# EAGLE design CanShark (EAGLE 6.5.0)
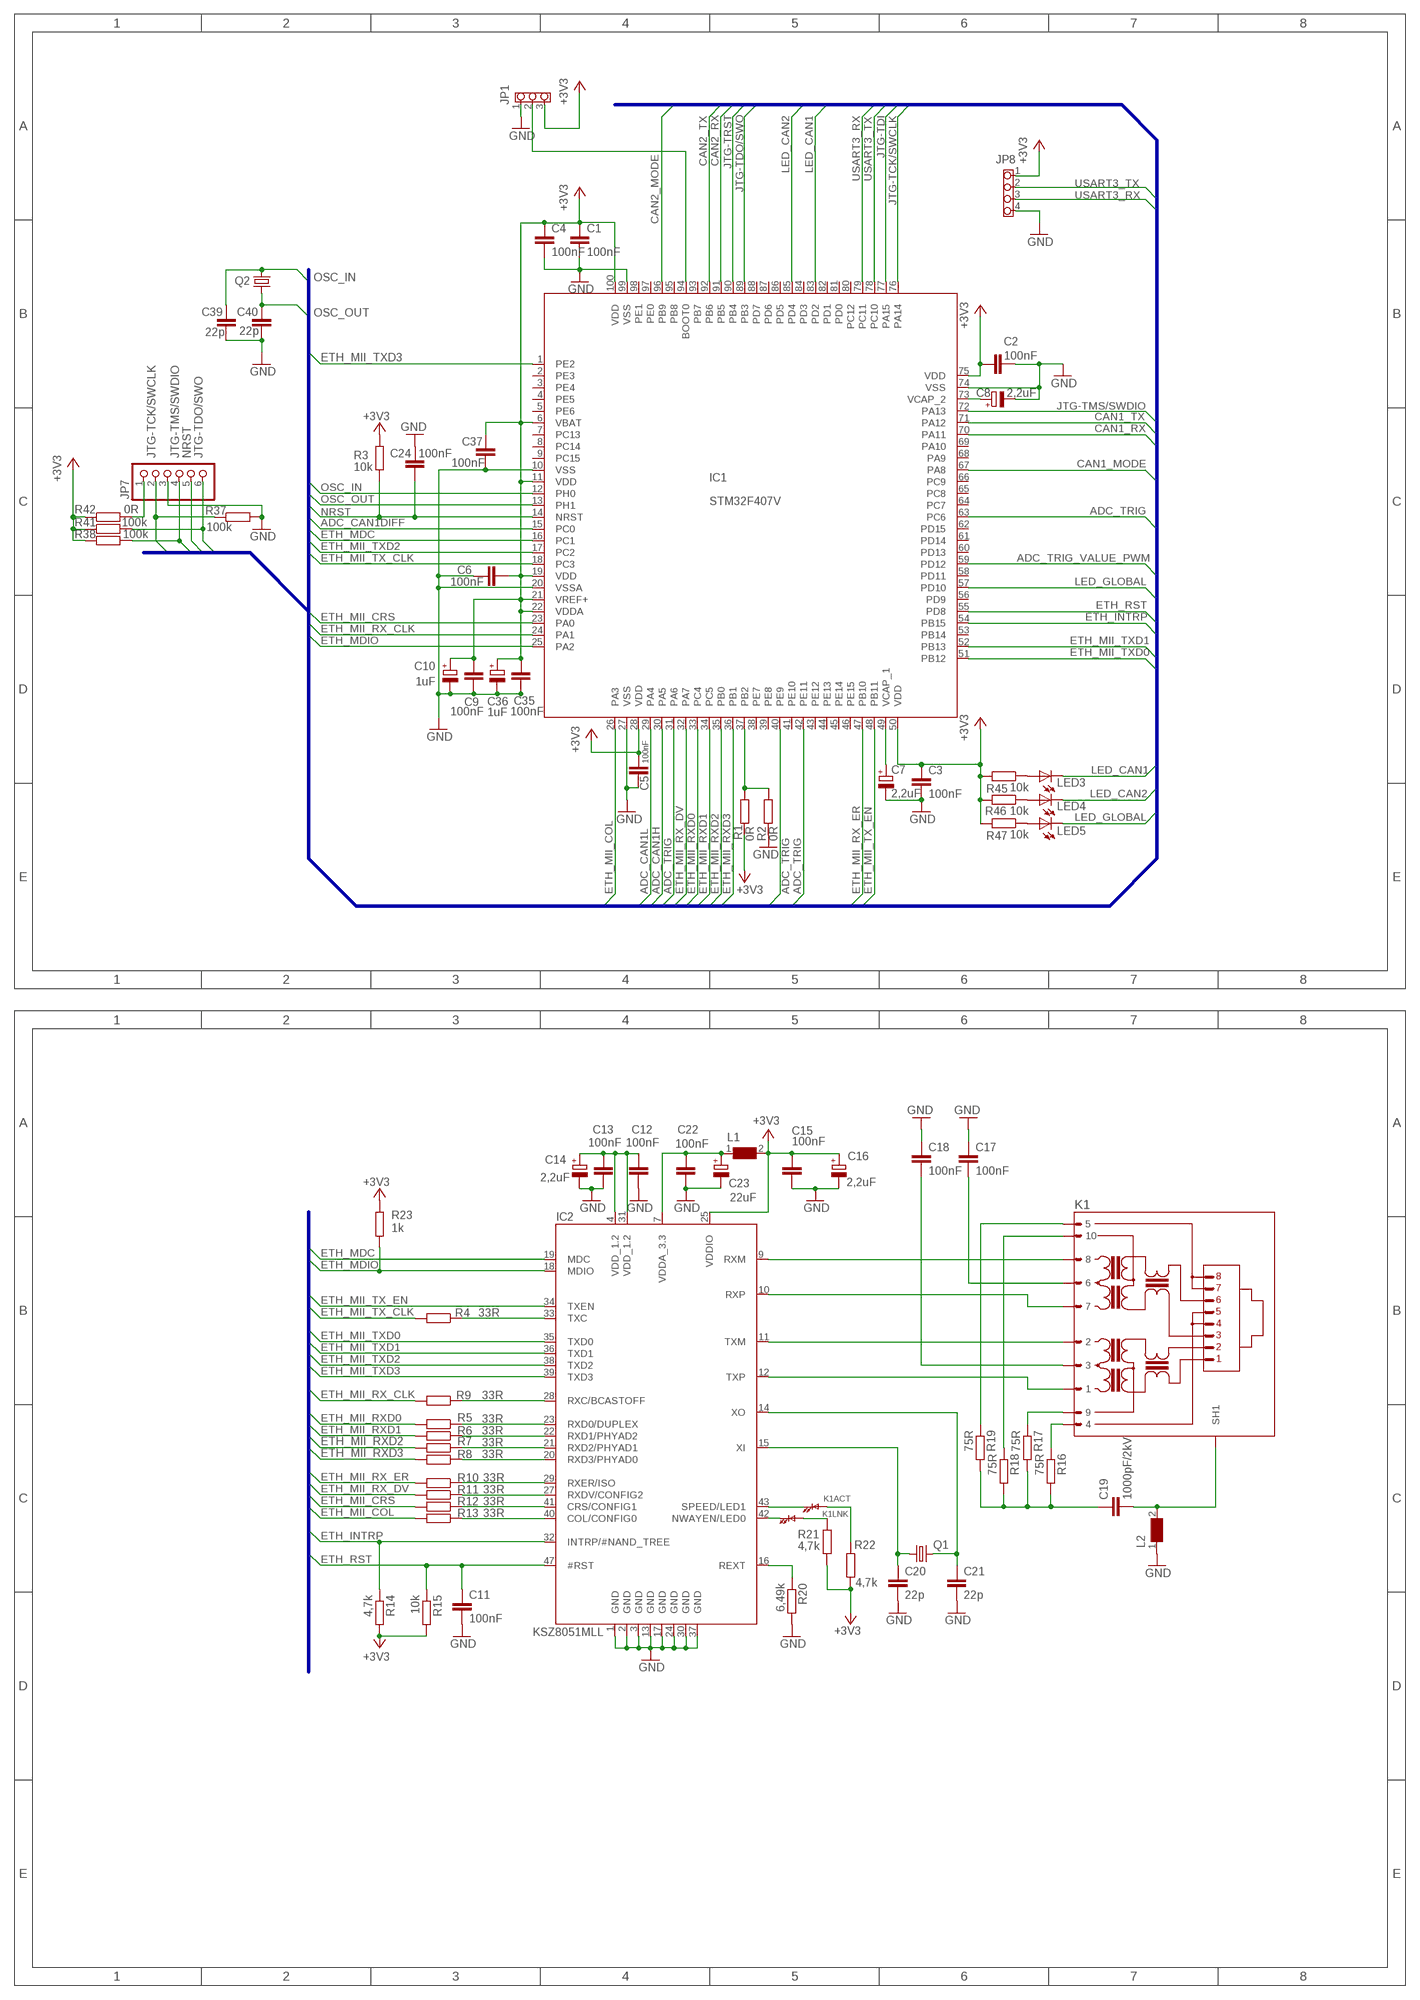
[diagram p0: schematic, sheet 1, part 1 of 3]
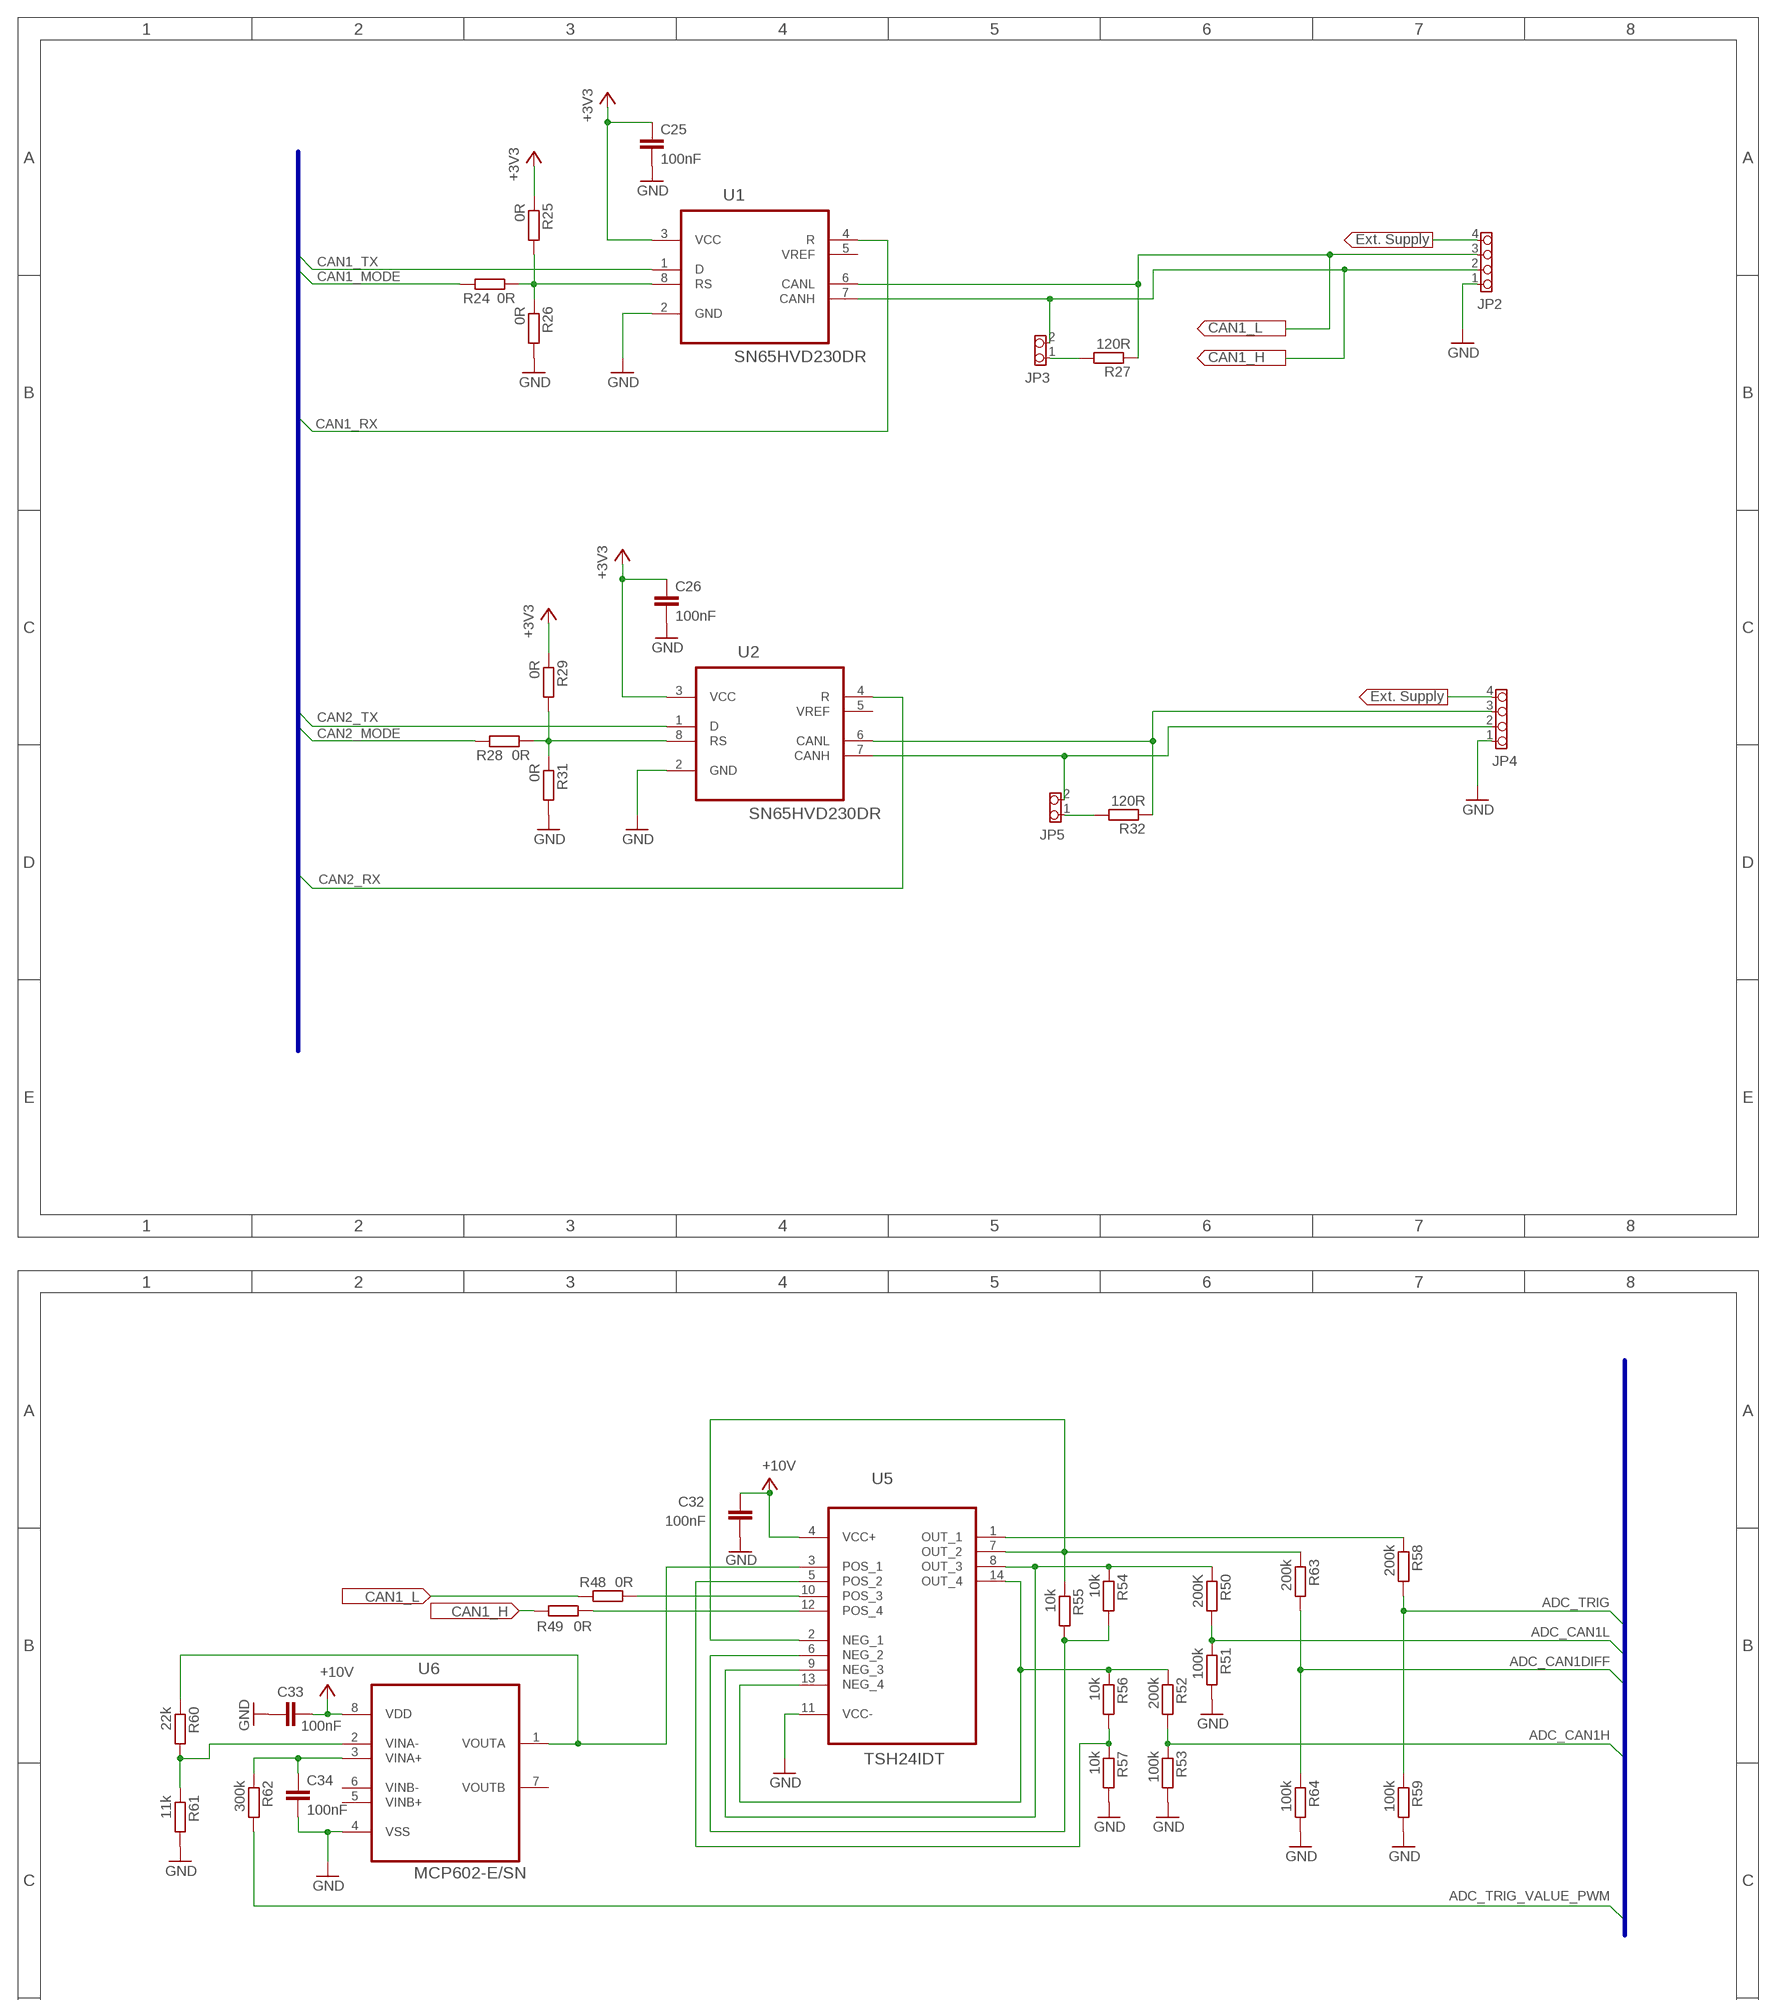
[diagram p1: schematic, sheet 1, part 2 of 3]
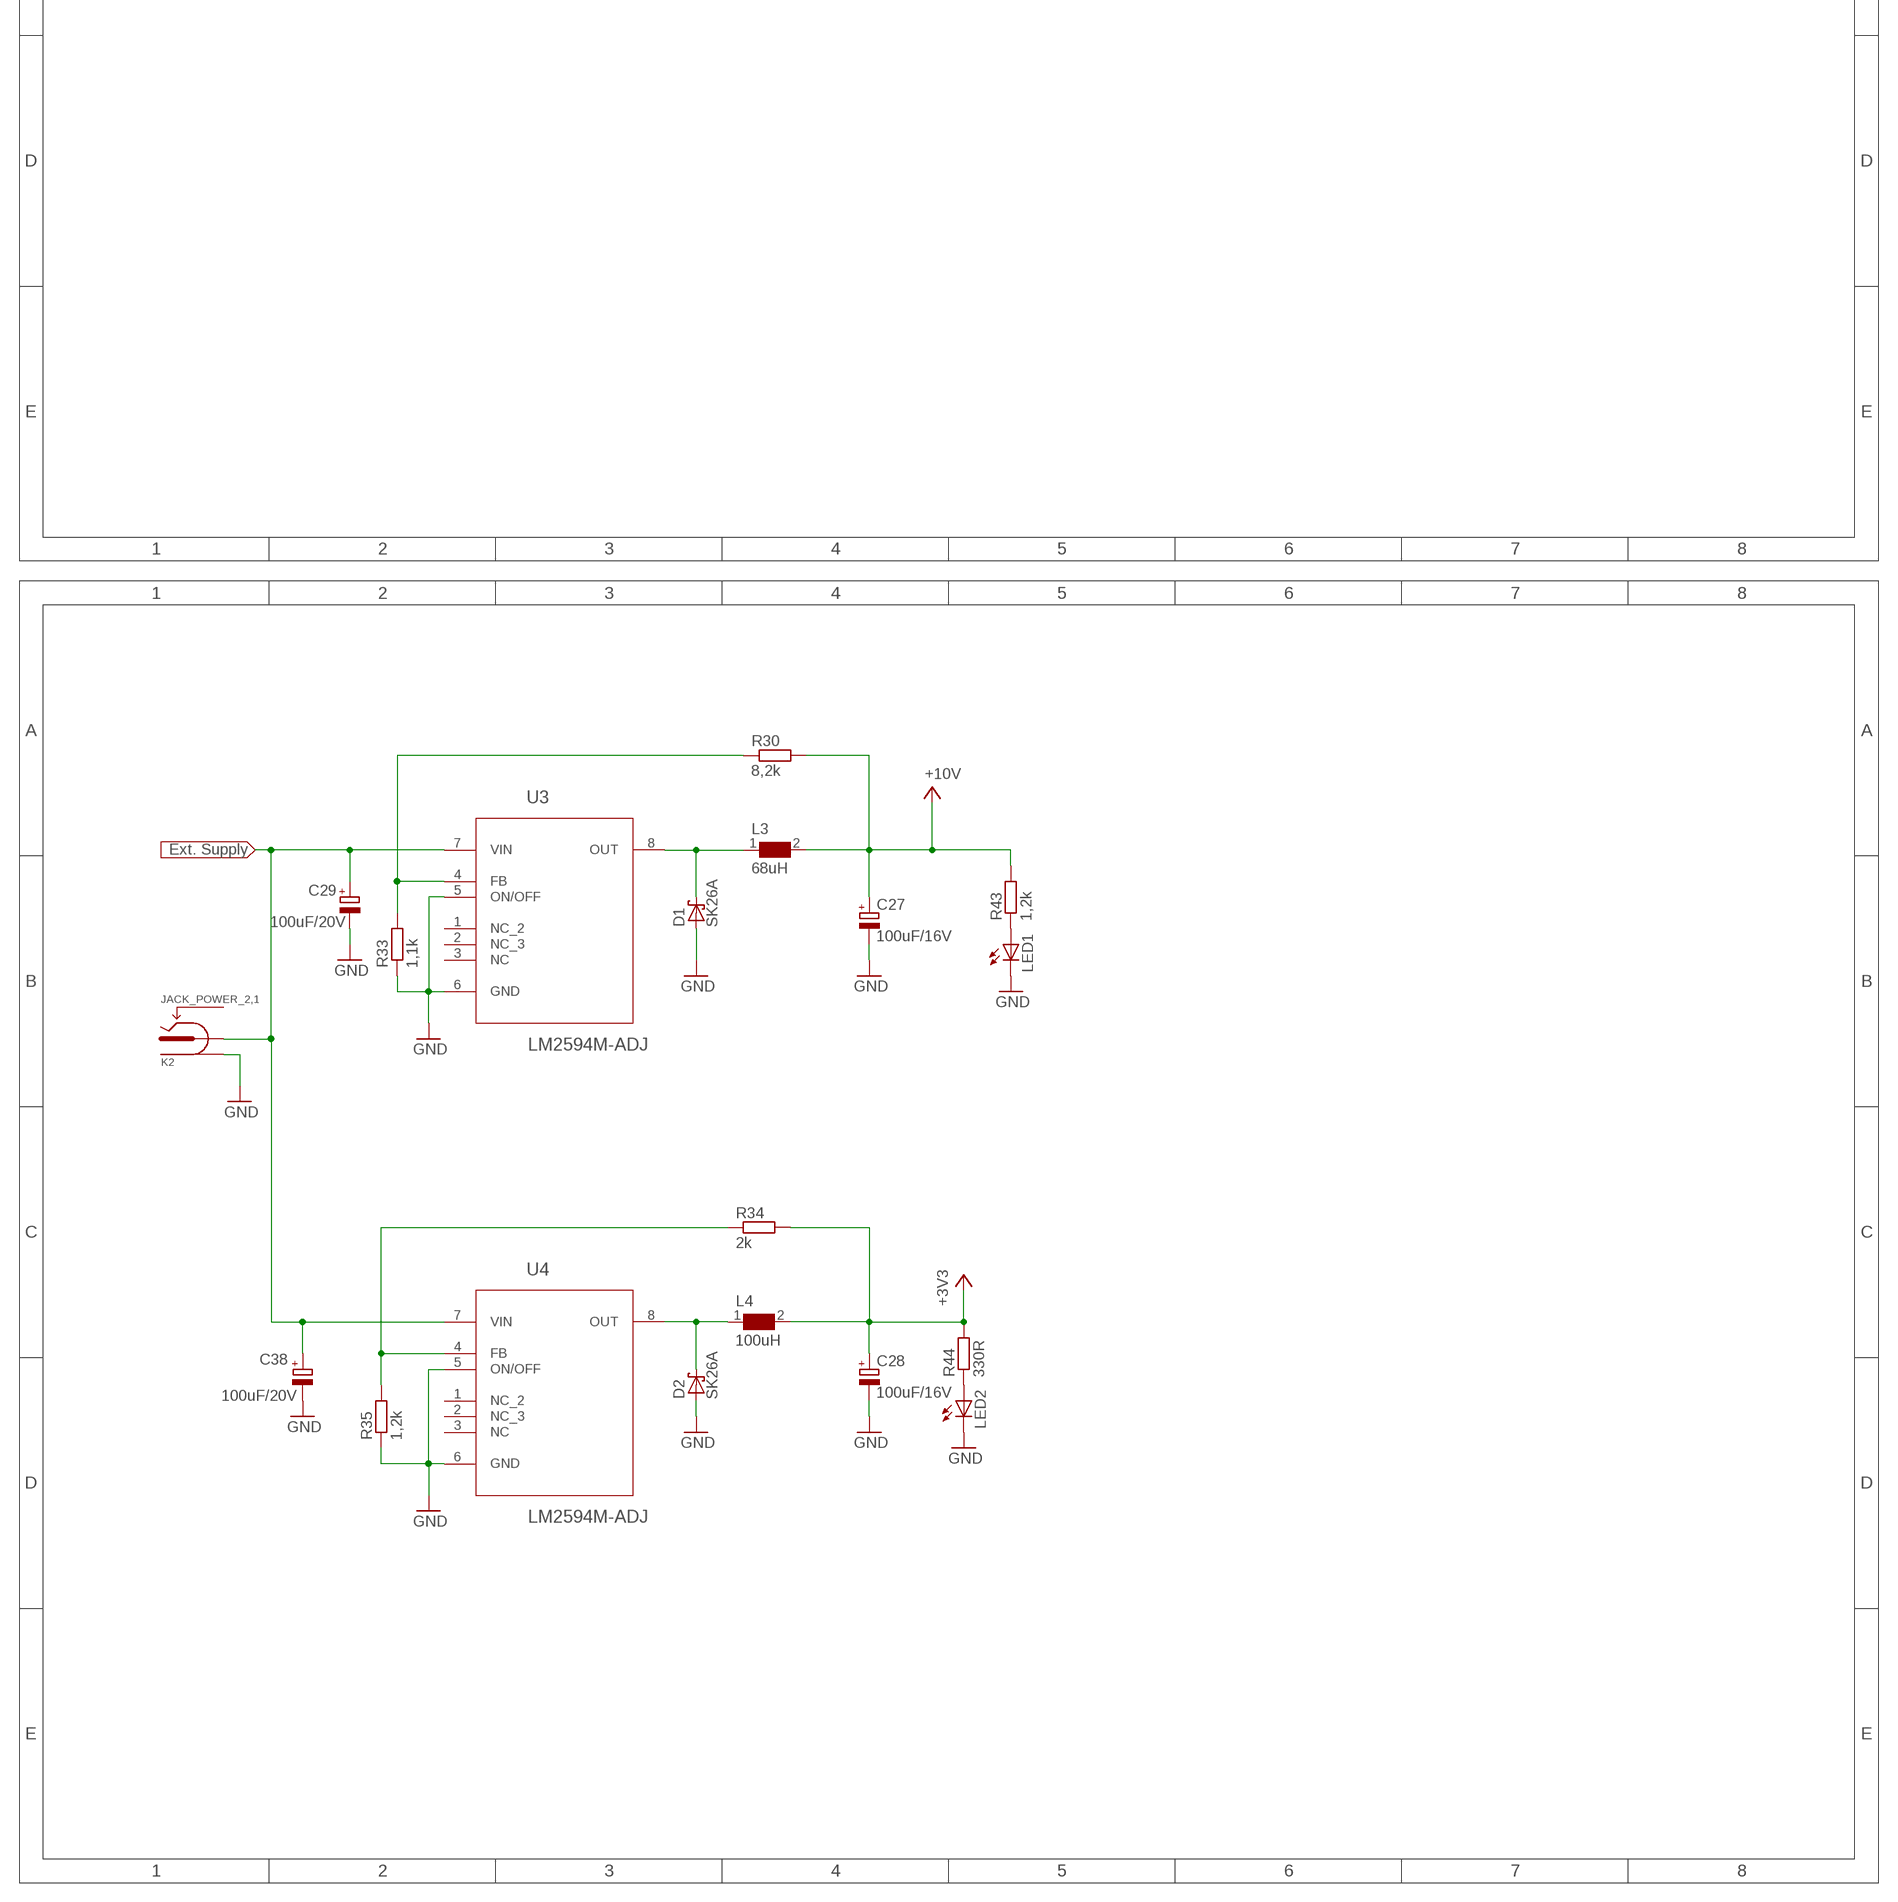
[diagram p2: schematic, sheet 1, part 3 of 3]

## Parts
C1  100nF  KERAMICKYSMD0603  [SMD0603]
C2  100nF  KERAMICKYSMD0603  [SMD0603]
C3  100nF  KERAMICKYSMD0603  [SMD0603]
C4  100nF  KERAMICKYSMD0603  [SMD0603]
C5  100nF  KERAMICKYSMD0603  [SMD0603]
C6  100nF  KERAMICKYSMD0603  [SMD0603]
C7  2,2uF  CPOL-EUSMCA  [SMC_A]
C8  2,2uF  CPOL-EUSMCA  [SMC_A]
C9  100nF  KERAMICKYSMD0603  [SMD0603]
C10  1uF  CPOL-EUSMCA  [SMC_A]
C11  100nF  KERAMICKYSMD0603  [SMD0603]
C12  100nF  KERAMICKYSMD0603  [SMD0603]
C13  100nF  KERAMICKYSMD0603  [SMD0603]
C14  2,2uF  CPOL-EUSMCA  [SMC_A]
C15  100nF  KERAMICKYSMD0603  [SMD0603]
C16  2,2uF  CPOL-EUSMCA  [SMC_A]
C17  100nF  KERAMICKYSMD0603  [SMD0603]
C18  100nF  KERAMICKYSMD0603  [SMD0603]
C19  1000pF/2kV  KERAMICKYSMD1206  [SMD1206]
C20  22p  KERAMICKYSMD0603  [SMD0603]
C21  22p  KERAMICKYSMD0603  [SMD0603]
C22  100nF  KERAMICKYSMD0603  [SMD0603]
C23  22uF  CPOL-EUSMCA  [SMC_A]
C24  100nF  KERAMICKYSMD0603  [SMD0603]
C25  100nF  KERAMICKYSMD0603  [SMD0603]
C26  100nF  KERAMICKYSMD0603  [SMD0603]
C27  100uF/16V  CPOL-EUC/6032-28R  [C/6032-28R]
C28  100uF/16V  CPOL-EUC/6032-28R  [C/6032-28R]
C29  100uF/20V  CPOL-EUC/6032-28R  [C/6032-28R]
C32  100nF  KERAMICKYSMD0603  [SMD0603]
C33  100nF  KERAMICKYSMD0603  [SMD0603]
C34  100nF  KERAMICKYSMD0603  [SMD0603]
C35  100nF  KERAMICKYSMD0603  [SMD0603]
C36  1uF  CPOL-EUSMCA  [SMC_A]
C37  100nF  KERAMICKYSMD0603  [SMD0603]
C38  100uF/20V  CPOL-EUC/6032-28R  [C/6032-28R]
C39  22p  KERAMICKYSMD0603  [SMD0603]
C40  22p  KERAMICKYSMD0603  [SMD0603]
D1  SK26A  SCHOTTKY-DIODESMD  [SMB]
D2  SK26A  SCHOTTKY-DIODESMD  [SMB]
IC1  STM32F407V  [LQFP100]
IC2  KSZ8051MLL  [LQFP48]
JP1  PINHD-1X3  [1X03_254]
JP2  PINHD-1X4_508_H  [1X04_508_H]
JP3  PINHD-1X2  [1X02_254]
JP4  PINHD-1X4_508_H  [1X04_508_H]
JP5  PINHD-1X2  [1X02_254]
JP7  PINHD-1X6  [1X06]
JP8  PINHD-1X4  [1X04_254]
K1  RJ45_TRAFO  [RJ45_TRAFO]
K2  JACK_POWER_2,1  [J_P_2,1]
L1  WE-CBF_HF-742863122_0603  [0603]
L2  WE-CBF_HF-742863122_0603  [0603]
L3  68uH  WE-TPC-744066180_1028/1038  [WE-TPC_1028/1038]
L4  100uH  WE-TPC-744066180_1028/1038  [WE-TPC_1028/1038]
LED1  LEDSML0603  [SML0603]
LED2  LEDSML0603  [SML0603]
LED3  TLLG4400  [LED3MM]
LED4  TLLG4400  [LED3MM]
LED5  TLLG4400  [LED3MM]
Q1  CRYSTALHC49U-V  [HC49U-V]
Q2  CRYSTALHC49U-V  [HC49U-V]
R1  0R  R-EU_R0603  [R0603]
R2  0R  R-EU_R0603  [R0603]
R3  10k  R-EU_R0603  [R0603]
R4  33R  R-EU_R0603  [R0603]
R5  33R  R-EU_R0603  [R0603]
R6  33R  R-EU_R0603  [R0603]
R7  33R  R-EU_R0603  [R0603]
R8  33R  R-EU_R0603  [R0603]
R9  33R  R-EU_R0603  [R0603]
R10  33R  R-EU_R0603  [R0603]
R11  33R  R-EU_R0603  [R0603]
R12  33R  R-EU_R0603  [R0603]
R13  33R  R-EU_R0603  [R0603]
R14  4,7k  R-EU_R0603  [R0603]
R15  10k  R-EU_R0603  [R0603]
R16  75R  R-EU_R0603  [R0603]
R17  75R  R-EU_R0603  [R0603]
R18  75R  R-EU_R0603  [R0603]
R19  75R  R-EU_R0603  [R0603]
R20  6,49k  R-EU_R0603  [R0603]
R21  4,7k  R-EU_R0603  [R0603]
R22  4,7k  R-EU_R0603  [R0603]
R23  1k  R-EU_R0603  [R0603]
R24  0R  R-EU_R0603  [R0603]
R25  0R  R-EU_R0603  [R0603]
R26  0R  R-EU_R0603  [R0603]
R27  120R  R-EU_R0603  [R0603]
R28  0R  R-EU_R0603  [R0603]
R29  0R  R-EU_R0603  [R0603]
R30  8,2k  R-EU_R0603  [R0603]
R31  0R  R-EU_R0603  [R0603]
R32  120R  R-EU_R0603  [R0603]
R33  1,1k  R-EU_R0603  [R0603]
R34  2k  R-EU_R0603  [R0603]
R35  1,2k  R-EU_R0603  [R0603]
R37  100k  R-EU_R0603  [R0603]
R38  100k  R-EU_R0603  [R0603]
R41  100k  R-EU_R0603  [R0603]
R42  0R  R-EU_R0603  [R0603]
R43  1,2k  R-EU_R0603  [R0603]
R44  330R  R-EU_R0603  [R0603]
R45  10k  R-EU_R0603  [R0603]
R46  10k  R-EU_R0603  [R0603]
R47  10k  R-EU_R0603  [R0603]
R48  0R  R-EU_R0603  [R0603]
R49  0R  R-EU_R0603  [R0603]
R50  200K  R-EU_R0603  [R0603]
R51  100k  R-EU_R0603  [R0603]
R52  200k  R-EU_R0603  [R0603]
R53  100k  R-EU_R0603  [R0603]
R54  10k  R-EU_R0603  [R0603]
R55  10k  R-EU_R0603  [R0603]
R56  10k  R-EU_R0603  [R0603]
R57  10k  R-EU_R0603  [R0603]
R58  200k  R-EU_R0603  [R0603]
R59  100k  R-EU_R0603  [R0603]
R60  22k  R-EU_R0603  [R0603]
R61  11k  R-EU_R0603  [R0603]
R62  300k  R-EU_R0603  [R0603]
R63  200k  R-EU_R0603  [R0603]
R64  100k  R-EU_R0603  [R0603]
U1  SN65HVD230DR  [SOIC127P600X175-8N]
U2  SN65HVD230DR  [SOIC127P600X175-8N]
U3  LM2594M-ADJ  [SOIC127P620X175-8N]
U4  LM2594M-ADJ  [SOIC127P620X175-8N]
U5  TSH24IDT  [SOIC127P600X175-14N]
U6  MCP602-E/SN  [SOIC127P600X175-8N]

## Nets
+3V3: C1.1 C2.1 C3.1 C4.1 C5.1 C6.2 C9.2 C10.+ C15.1 C16.+ C25.1 C26.1 C28.+ C35.2 C36.+ C37.2 IC1.6(VBAT) IC1.11(VDD) IC1.19(VDD) IC1.21(VREF+) IC1.22(VDDA) IC1.28(VDD) IC1.50(VDD) IC1.75(VDD) IC1.100(VDD) IC2.25(VDDIO) JP1.3 JP8.1 L1.2 L4.2 R1.1 R3.2 R14.2 R15.2 R21.1 R22.1 R23.1 R25.1 R29.1 R34.2 R38.1 R41.1 R42.1 R44.2 R45.2 R46.2 R47.2 U1.3(VCC) U2.3(VCC)
ADC_CAN1DIFF: IC1.15(PC0) R63.2 R64.1
ADC_CAN1H: IC1.30(PA5) R52.2 R53.1
ADC_CAN1L: IC1.29(PA4) R50.2 R51.1
ADC_TRIG: IC1.31(PA6) IC1.40(PE9) IC1.42(PE11) IC1.63(PC6) R58.2 R59.1
ADC_TRIG_VALUE_PWM: IC1.59(PD12) R62.2
CAN1_H: JP2.2 JP3.2 R49.2 U1.7(CANH)
CAN1_L: JP2.3 R27.1 R48.2 U1.6(CANL)
CAN1_MODE: IC1.67(PA8) R24.1
CAN1_RX: IC1.70(PA11) U1.4(R)
CAN1_TX: IC1.71(PA12) U1.1(D)
CAN2_MODE: IC1.96(PB9) R28.1
CAN2_RX: IC1.91(PB5) U2.4(R)
CAN2_TX: IC1.92(PB6) U2.1(D)
CANL: JP4.3 R32.1 U2.6(CANL)
ETH_INTRP: IC1.54(PB15) IC2.32(INTRP/#NAND_TREE) R14.1
ETH_MDC: IC1.16(PC1) IC2.19(MDC)
ETH_MDIO: IC1.25(PA2) IC2.18(MDIO) R23.2
ETH_MII_COL: IC1.26(PA3) R13.2
ETH_MII_CRS: IC1.23(PA0) R12.2
ETH_MII_RX_CLK: IC1.24(PA1) R9.2
ETH_MII_RX_DV: IC1.32(PA7) R11.2
ETH_MII_RX_ER: IC1.47(PB10) R10.2
ETH_MII_RXD0: IC1.33(PC4) R5.2
ETH_MII_RXD1: IC1.34(PC5) R6.2
ETH_MII_RXD2: IC1.35(PB0) R7.2
ETH_MII_RXD3: IC1.36(PB1) R8.2
ETH_MII_TX_CLK: IC1.18(PC3) R4.2
ETH_MII_TX_EN: IC1.48(PB11) IC2.34(TXEN)
ETH_MII_TXD0: IC1.51(PB12) IC2.35(TXD0)
ETH_MII_TXD1: IC1.52(PB13) IC2.36(TXD1)
ETH_MII_TXD2: IC1.17(PC2) IC2.38(TXD2)
ETH_MII_TXD3: IC1.1(PE2) IC2.39(TXD3)
ETH_RST: C11.1 IC1.55(PD8) IC2.47(#RST) R15.1
EXTSUPPLY: C29.+ C38.+ JP2.4 JP4.4 K2.A U3.7(VIN) U4.7(VIN)
GND: C1.2 C2.2 C3.2 C4.2 C5.2 C6.1 C7.- C8.- C9.1 C10.- C11.2 C12.2 C13.2 C14.- C15.2 C16.- C17.1 C18.1 C20.2 C21.2 C22.2 C23.- C24.2 C25.2 C26.2 C27.- C28.- C29.- C32.2 C33.2 C34.2 C35.1 C36.- C37.1 C38.- C39.2 C40.2 D1.A D2.A IC1.10(VSS) IC1.20(VSSA) IC1.27(VSS) IC1.74(VSS) IC1.99(VSS) IC2.1(GND) IC2.2(GND) IC2.3(GND) IC2.13(GND) IC2.17(GND) IC2.24(GND) IC2.30(GND) IC2.37(GND) JP1.1 JP2.1 JP4.1 JP7.3 JP8.4 K2.B L2.1 LED1.C LED2.C R2.1 R20.2 R26.2 R31.2 R33.1 R35.1 R37.2 R51.2 R53.2 R57.2 R59.2 R61.2 R64.2 U1.2(GND) U2.2(GND) U3.5(ON/OFF) U3.6(GND) U4.5(ON/OFF) U4.6(GND) U5.11(VCC-) U6.4(VSS)
JTG-TCK/SWCLK: IC1.76(PA14) JP7.2 R37.1
JTG-TDI: IC1.77(PA15)
JTG-TDO/SWO: IC1.89(PB3) JP7.6 R41.2
JTG-TMS/SWDIO: IC1.72(PA13) JP7.4 R38.2
JTG-TRST: IC1.90(PB4)
LED_CAN1: IC1.83(PD2) LED3.K(C)
LED_CAN2: IC1.85(PD4) LED4.K(C)
LED_GLOBAL: IC1.57(PD10) LED5.K(C)
N$1: IC1.94(BOOT0) JP1.2
N$2: C7.+ IC1.49(VCAP_1)
N$4: C8.+ IC1.73(VCAP_2)
N$5: JP3.1 R27.2
N$6: IC1.37(PB2) R1.2 R2.2
N$7: D1.C L3.1 U3.8(OUT)
N$9: C22.1 C23.+ IC2.7(VDDA_3.3) L1.1
N$10: IC2.33(TXC) R4.1
N$12: R24.2 R25.2 R26.1 U1.8(RS)
N$14: JP4.2 JP5.2 U2.7(CANH)
N$16: IC2.28(RXC/BCASTOFF) R9.1
N$17: R28.2 R29.2 R31.1 U2.8(RS)
N$18: IC2.23(RXD0/DUPLEX) R5.1
N$19: IC2.22(RXD1/PHYAD2) R6.1
N$20: IC2.21(RXD2/PHYAD1) R7.1
N$21: IC2.20(RXD3/PHYAD0) R8.1
N$22: IC2.29(RXER/ISO) R10.1
N$23: IC2.27(RXDV/CONFIG2) R11.1
N$24: IC2.41(CRS/CONFIG1) R12.1
N$25: IC2.40(COL/CONFIG0) R13.1
N$26: JP5.1 R32.2
N$27: JP7.1 R42.2
N$28: D2.C L4.1 U4.8(OUT)
N$29: R34.1 R35.2 U4.4(FB)
N$30: R30.1 R33.2 U3.4(FB)
N$35: LED1.A R43.1
N$36: C12.1 C13.1 C14.+ IC2.4(VDD_1.2) IC2.31(VDD_1.2)
N$37: IC2.9(RXM) K1.8
N$38: IC2.10(RXP) K1.7
N$39: IC2.11(TXM) K1.2
N$40: IC2.12(TXP) K1.1
N$41: K1.4 R16.1
N$42: K1.9 R17.1
N$43: K1.10 R18.1
N$44: K1.5 R19.1
N$45: C19.1 R16.2 R17.2 R18.2 R19.2
N$46: C17.2 K1.6
N$47: C18.2 K1.3
N$48: C19.2 K1.SH1 K1.SH2(SH1) L2.2
N$49: IC2.16(REXT) R20.1
N$50: IC2.42(NWAYEN/LED0) K1.K_G(K)
N$51: IC2.43(SPEED/LED1) K1.K_Y(K)
N$52: K1.A_Y(A) R22.2
N$53: K1.A_G(A) R21.2
N$54: LED2.A R44.1
N$55: C21.1 IC2.14(XO) Q1.2
N$56: C20.1 IC2.15(XI) Q1.1
N$57: LED3.A R45.1
N$58: LED4.A R46.1
N$59: LED5.A R47.1
N$60: R52.1 R56.1 U5.13(NEG_4) U5.14(OUT_4)
N$61: R50.1 R54.1 U5.8(OUT_3) U5.9(NEG_3)
N$62: R49.1 U5.12(POS_4)
N$63: R48.1 U5.10(POS_3)
N$65: R55.1 R63.1 U5.2(NEG_1) U5.7(OUT_2)
N$66: R54.2 R55.2 U5.6(NEG_2)
N$67: R56.2 R57.1 U5.5(POS_2)
N$68: R60.1 U5.3(POS_1) U6.1(VOUTA)
N$69: R58.1 U5.1(OUT_1)
N$70: R60.2 R61.1 U6.2(VINA-)
N$71: C34.1 R62.1 U6.3(VINA+)
NRST: C24.1 IC1.14(NRST) JP7.5 R3.1
OSC_IN: C39.1 IC1.12(PH0) Q2.2
OSC_OUT: C40.1 IC1.13(PH1) Q2.1
USART3_RX: IC1.79(PC11) JP8.3
USART3_TX: IC1.78(PC10) JP8.2
V+: C27.+ C32.1 C33.1 L3.2 R30.2 R43.2 U5.4(VCC+) U6.8(VDD) ; supply symbol labelled +10V
Unconnected: IC1.2(PE3) IC1.3(PE4) IC1.4(PE5) IC1.5(PE6) IC1.7(PC13) IC1.8(PC14) IC1.9(PC15) IC1.38(PE7) IC1.39(PE8) IC1.41(PE10) IC1.43(PE12) IC1.44(PE13) IC1.45(PE14) IC1.46(PE15) IC1.53(PB14) IC1.56(PD9) IC1.58(PD11) IC1.60(PD13) IC1.61(PD14) IC1.62(PD15) IC1.64(PC7) IC1.65(PC8) IC1.66(PC9) IC1.68(PA9) IC1.69(PA10) IC1.80(PC12) IC1.81(PD0) IC1.82(PD1) IC1.84(PD3) IC1.86(PD5) IC1.87(PD6) IC1.88(PD7) IC1.93(PB7) IC1.95(PB8) IC1.97(PE0) IC1.98(PE1) K2.BK U1.5(VREF) U2.5(VREF) U3.1(NC_2) U3.2(NC_3) U3.3(NC) U4.1(NC_2) U4.2(NC_3) U4.3(NC) U6.5(VINB+) U6.6(VINB-) U6.7(VOUTB)

## Buses
ADC_TRIG,ADC_CAN1L,ADC_CAN1H,ADC_TRIG_VALUE_PWM,CAN2_TX,CAN2_RX,CAN2_MODE,CAN1_TX,CAN1_RX,CAN1_MODE,ETH_MDC,ETH_MDIO,ETH_MII_TX_EN,ETH_MII_TX_CLK,ETH_MII_TXD[0..3],ETH_MII_RX_CLK,ETH_MII_RXD[0..3],ETH_MII_RX_ER,ETH_MII_RX_DV,ETH_MII_CRS,ETH_MII_COL,ETH_INTRP,ETH_RST,JTG-TRST,JTG-TDI,JTG-TMS/SWDIO,JTG-TCK/SWCLK,JTG-TDO/SWO,NRST,ADC_CAN1DIFF,LED_CAN1,LED_CAN2,LED_GLOBAL,USART3_TX,USART3_RX,OSC_IN,OSC_OUT

## Library data of the parts
C1-C6 C9 C11-C13 C15 C17-C22 C24-C26 C32-C35 C37 C39 C40 = #Kondenzatory:KERAMICKY
C7 C8 C10 C14 C16 C23 C27-C29 C36 C38 = rcl:CPOL-EU: POLARIZED CAPACITOR, European symbol
D1 D2 = diode:SCHOTTKY-DIODE: Schottky Diode
IC1 = !ic_stm32:STM32F4*V: IC Mikrokontroler
IC2 = !ic_micrel:KSZ8051MLL: IO - Ethernet PHY
JP1 = !pinhead:PINHD-1X3: Konektor 3 PIN Typ Rastr Imax Umax Rmax Kontakt 2.54 mm 500 mA 125 V 50 mOhm krimp /90 2.54 mm 500 mA 125 V 50 mOhm krimp _MX5267 2.50 mm 2.5 A 250 V 20 mOhm krimp _MX53048 1.25 mm 800 mA 125 V 20 mOhm krimp _PV-3.81 3.81 mm 8 A 130 V 30 mOhm ?roub
JP2 JP4 JP8 = !pinhead:PINHD-1X4: Konektor 4 PIN Typ Rastr Imax Umax Rmax Kontakt 2.54 mm 500 mA 125 V 50 mOhm krimp /90 2.54 mm 500 mA 125 V 50 mOhm krimp _MX5267 2.50 mm 2.5 A 250 V 20 mOhm krimp _MX53048 1.25 mm 800 mA 125 V 20 mOhm krimp _PV-3.81 3.81 mm 8 A 130 V 30 mOhm ?roub
JP3 JP5 = !pinhead:PINHD-1X2: Konektor 2 PIN Typ Rastr Imax Umax Rmax Kontakt 2.54 mm 500 mA 125 V 50 mOhm krimp /90 2.54 mm 500 mA 125 V 50 mOhm krimp _MX5267 2.50 mm 2.5 A 250 V 20 mOhm krimp _MX53048 1.25 mm 800 mA 125 V 20 mOhm krimp _PV-3.81 3.81 mm 8 A 130 V 30 mOhm ?roub
JP7 = pinhead:PINHD-1X6: PIN HEADER
K1 = !konektor:RJ45_TRAFO: Konektor RJ45 RJ45 socket with LED and transofrmator Manufaturer: Wenzhou Yihua Communicated Connector Co. Ltd. Forward current LED = 20mA Typical voltage: Green LED Yellow LED 2.2V 2.1V c 2007 ROFA.CZ
K2 = !konektor:JACK_POWER_?
L1 L2 = WE-CBF_HF:WE-CBF_HF: SMD EMI Suppression Ferrite Beads WE-CBF HF; MPN: 742863122; OC_FARNELL: 1748575; OC_NEWARK: 34R5899; PACKAGE: IND-0603_1; SUPPLIER: Wuerth Elektronik
L3 L4 = WE-TPC:WE-TPC: Shielded Tiny Power Inductor WE-TPC - Extremely flat power inductor - High current capability - High reliability and perfect soldering characteristics because of integrated soldering pad - magnetically shielded -- Portable power like PDA, digital camera, PCMICA-cards and displays -- DC/DC-converter -- Recommended for switching regulator IC's from Linear Technology, National Semiconductor, Texas Instruments and Fairchild Semiconductor; MPN: 744066180; OC_FARNELL: 2211515; OC_NEWARK: 44W4565; PACKAGE: 1038; SUPPLIER: WURTH ELEKTRONIK
LED1 LED2 = led:LED: LED OSRAM: - CHIPLED LG R971, LG N971, LY N971, LG Q971, LY Q971, LO R971, LY R971 LH N974, LH R974 LS Q976, LO Q976, LY Q976 LO Q996 - Hyper CHIPLED LW Q18S LB Q993, LB Q99A, LB R99A - SideLED LS A670, LO A670, LY A670, LG A670, LP A670 LB A673, LV A673, LT A673, LW A673 LH A674 LY A675 LS A676, LA A676, LO A676, LY A676, LW A676 LS A679, LY A679, LG A679 - Hyper Micro SIDELED® LS Y876, LA Y876, LO Y876, LY Y876 LT Y87S - SmartLED LW L88C, LW L88S LB L89C, LB L89S, LG L890 LS L89K, LO L89K, LY L89K LS L896, LA L896, LO L896, LY L896 - TOPLED LS T670, LO T670, LY T670, LG T670, LP T670 LSG T670, LSP T670, LSY T670, LOP T670, LYG T670 LG T671, LOG T671, LSG T671 LB T673, LV T673, LT T673, LW T673 LH T674 LS T676, LA T676, LO T676, LY T676, LB T676, LH T676, LSB T676, LW T676 LB T67C, LV T67C, LT T67C, LS T67K, LO T67K, LY T67K, LW E67C LS E67B, LA E67B, LO E67B, LY E67B, LB E67C, LV E67C, LT E67C LW T67C LS T679, LY T679, LG T679 LS T770, LO T770, LY T770, LG T770, LP T770 LB T773, LV T773, LT T773, LW T773 LH T774 LS E675, LA E675, LY E675, LS T675 LS T776, LA T776, LO T776, LY T776, LB T776 LHGB T686 LT T68C, LB T68C - Hyper Mini TOPLED® LB M676 - Mini TOPLED Santana® LG M470 LS M47K, LO M47K, LY M47K Source: http://www.osram.convergy.de LUXEON: - LUMILED® LXK2-PW12-R00, LXK2-PW12-S00, LXK2-PW14-U00, LXK2-PW14-V00 LXK2-PM12-R00, LXK2-PM12-S00, LXK2-PM14-U00 LXK2-PE12-Q00, LXK2-PE12-R00, LXK2-PE12-S00, LXK2-PE14-T00, LXK2-PE14-U00 LXK2-PB12-K00, LXK2-PB12-L00, LXK2-PB12-M00, LXK2-PB14-N00, LXK2-PB14-P00, LXK2-PB14-Q00 LXK2-PR12-L00, LXK2-PR12-M00, LXK2-PR14-Q00, LXK2-PR14-R00 LXK2-PD12-Q00, LXK2-PD12-R00, LXK2-PD12-S00 LXK2-PH12-R00, LXK2-PH12-S00 LXK2-PL12-P00, LXK2-PL12-Q00, LXK2-PL12-R00 Source: www.luxeon.com KINGBRIGHT: KA-3528ASYC Source: www.kingbright.com
LED3-LED5 = led:TLLG4400: Low Current (2mA) LED 3 mm Tinted Diffused Package color GREEN Source: Data sheet <http://www.farnell.com/datasheets/391098.pdf>; MF: VISHAY SEMICONDUCTOR; OC_FARNELL: 1612435
Q1 Q2 = crystal:CRYSTAL: CRYSTAL; OC_FARNELL: 1666969; OC_NEWARK: unknown
R1-R35 R37 R38 R41-R64 = #Odpory:R-EU_: RESISTOR, European symbol
U1 U2 = TI_SM65HVD230_CAN_DRIVER:SN65HVD230DR: 3.3-V CAN TRANSCEIVERS; MPN: SN65HVD230DR; OC_FARNELL: 8452148; OC_NEWARK: 75C7745; PACKAGE: SOIC-8; SUPPLIER: Texas Instruments
U3 U4 = LM2594M-ADJ:LM2594M-ADJ: SIMPLE SWITCHER® Power Converter; MPN: LM2594M-ADJ; OC_FARNELL: 9494332; OC_NEWARK: 41K3819; PACKAGE: 8-SOIC; SUPPLIER: National Semiconductors
U5 = TSH24IDT:TSH24IDT: OPERATIONAL AMPLIFIERS; MPN: TSH24IDT; OC_FARNELL: 1750176; OC_NEWARK: 33R1395; PACKAGE: SOIC-14; SUPPLIER: STMICROELECTRONICS
U6 = MCP602:MCP602-E/SN: IC, 2.7V to 5.5V Single-Supply CMOS Dual Op Amps,SOIC-8; MPN: MCP602-E/SN; OC_FARNELL: 1852043; OC_NEWARK: 88H9871; PACKAGE: SOIC-8; SUPPLIER: Microchip

## Board
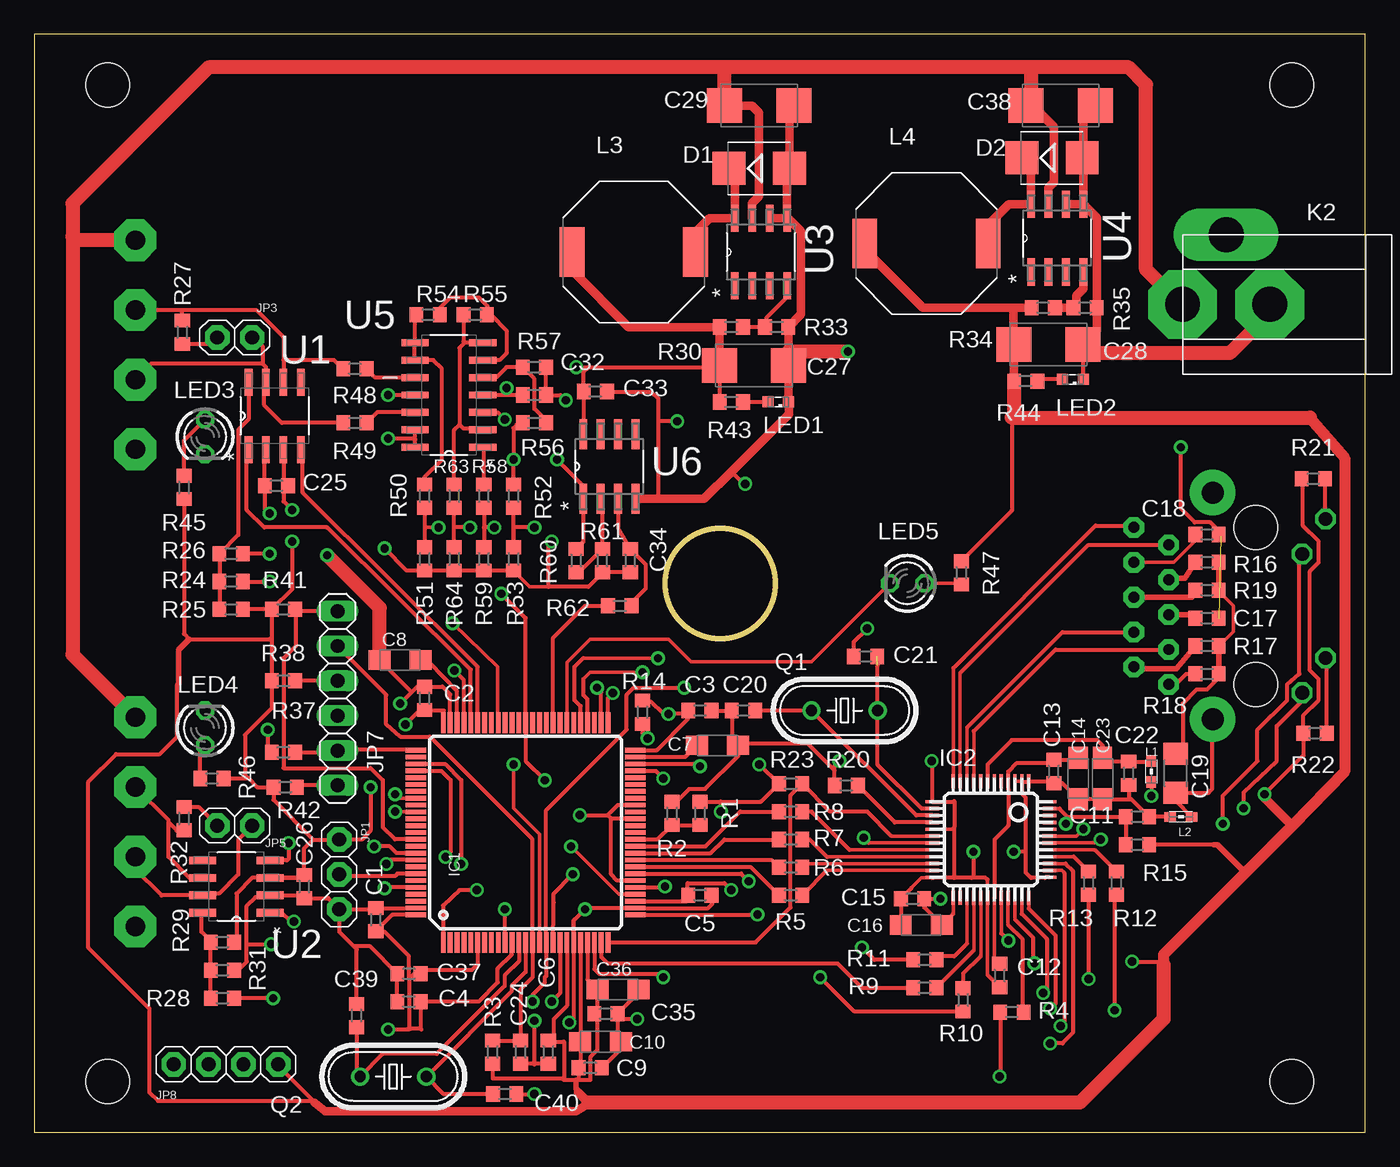
[diagram p3: board, top side]
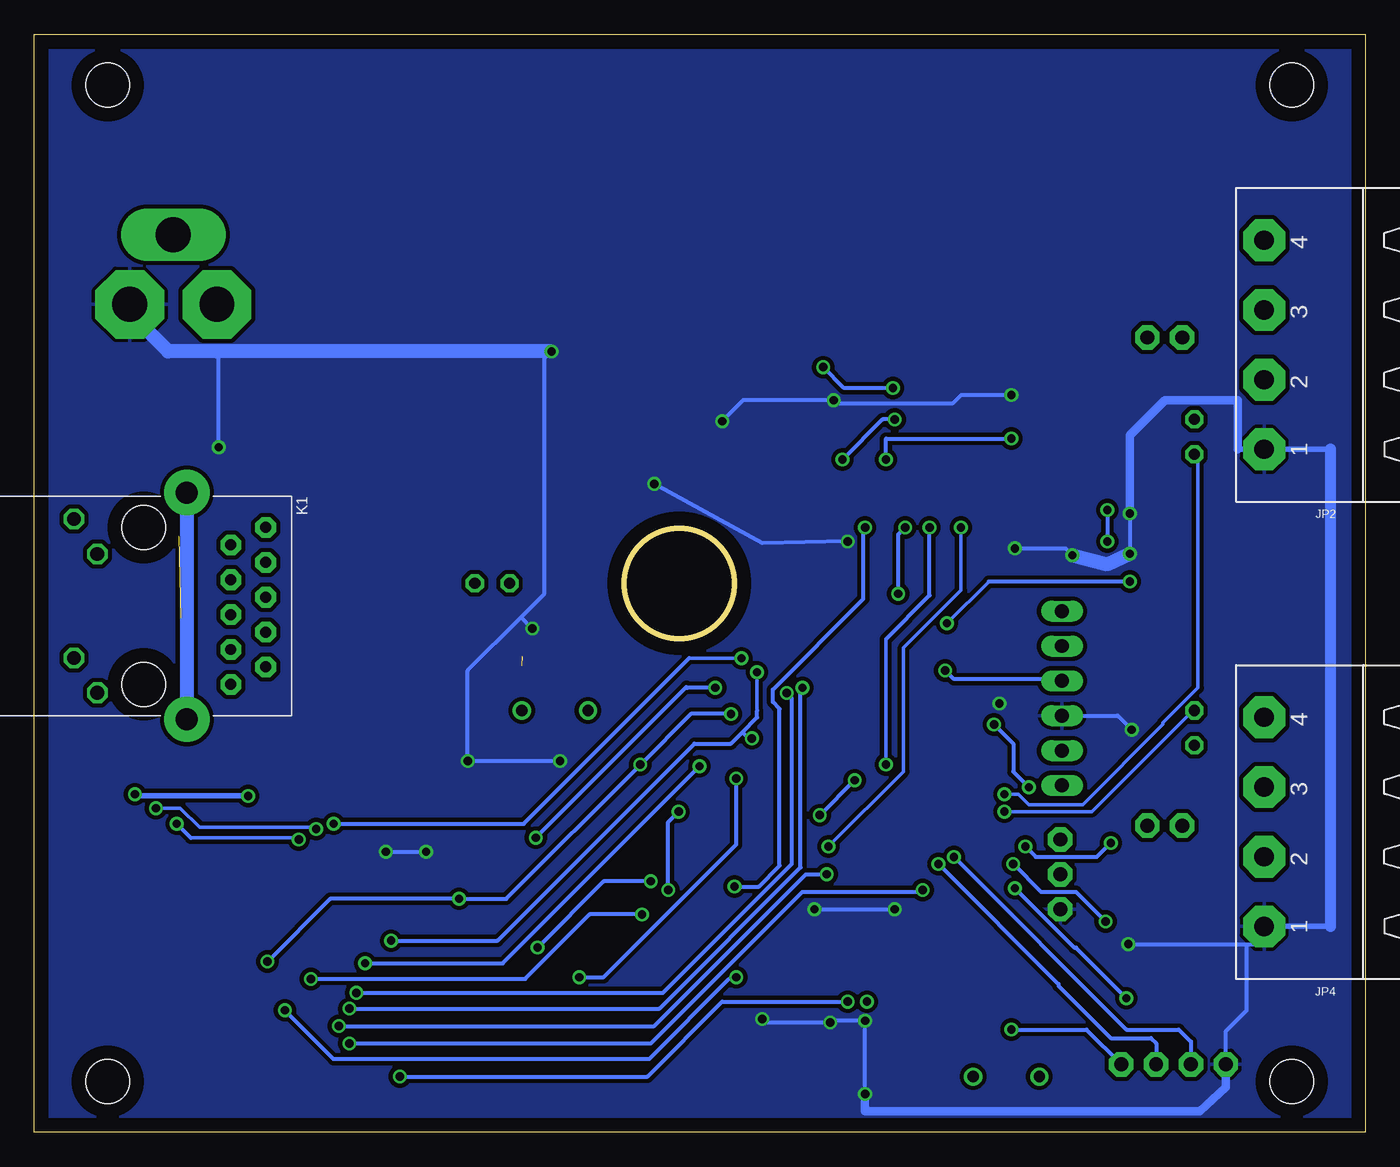
[diagram p4: board, bottom side, seen from below]

Size 97 x 80 mm. Coordinates in mm from the lower left corner, seen from the top.
Outline: 0,0 97,0 97,80 0,80 0,0
Outline: circle at 50,40 radius 4
Copper layers (1*16): Top 0.035mm / dielectric 1.5mm / Bottom 0.035mm
Design rules "default *": minimum track width 8mil, minimum drill 24mil, track to track 6mil, track to pad 6mil, pad to pad 6mil, via to via 6mil, smd to smd 6mil, copper to edge 40mil, drill to drill 8mil, minimum pad ring 10mil, minimum via ring 8mil, stop-mask expansion 4mil, vias tented up to drill 0mil, thermal gap 10mil
Holes 3.2 mm at 5.35,3.7 91.65,3.7 5.35,76.3 91.65,76.3
tKeepout: area 0,91.4 to 1.5,92; area 95.5,91.4 to 97,92; area 47.1,92.1 to 49.9,93.9; area 95.5,85.6 to 97,86.2; area 91.7,85.6 to 93.2,86.2; area 91.6,83.7 to 97.1,85.5; area 90.2,87.2 to 91.7,87.8; area 5.3,87.2 to 6.8,87.8; area 45.7,85.3 to 51.3,87.1; area 127,78.5 to 127.6,80; area 127,0.3 to 127.6,1.8; area 127.7,36.7 to 129.4,43.6; 30 more areas; 44 lines

### Footprints (pad centres in the part's own frame; a part is rotated, then mirrored left to right if it is on the bottom)
SMD0603 = smd 1 x 1.1: 1 -0.85,0; 2 0.85,0
SMC_A = smd 1.6 x 1.4: + -1.5,0; - 1.5,0
SMD1206 = smd 1.6 x 1.803: 1 -1.422,0; 2 1.422,0
C/6032-28R = smd 2.55 x 2.5: + 2.525,0; - -2.525,0
SMB = smd 2.4 x 2.4: A 2.2,0; C -2.2,0
LQFP100 = smd 1.5 x 0.35: 1 -8,6; 2 -8,5.5; 3 -8,5; 4 -8,4.5; 5 -8,4; 6 -8,3.5; 7 -8,3; 8 -8,2.5; 9 -8,2; 10 -8,1.5; 11 -8,1; 12 -8,0.5; 13 -8,0; 14 -8,-0.5; 15 -8,-1; 16 -8,-1.5; 17 -8,-2; 18 -8,-2.5; 19 -8,-3; 20 -8,-3.5; 21 -8,-4; 22 -8,-4.5; 23 -8,-5; 24 -8,-5.5; 25 -8,-6; 51 8,-6; 52 8,-5.5; 53 8,-5; 54 8,-4.5; 55 8,-4; 56 8,-3.5; 57 8,-3; 58 8,-2.5; 59 8,-2; 60 8,-1.5; 61 8,-1; 62 8,-0.5; 63 8,0; 64 8,0.5; 65 8,1; 66 8,1.5; 67 8,2; 68 8,2.5; 69 8,3; 70 8,3.5; 71 8,4; 72 8,4.5; 73 8,5; 74 8,5.5; 75 8,6 | smd 0.35 x 1.5: 26 -6,-8; 27 -5.5,-8; 28 -5,-8; 29 -4.5,-8; 30 -4,-8; 31 -3.5,-8; 32 -3,-8; 33 -2.5,-8; 34 -2,-8; 35 -1.5,-8; 36 -1,-8; 37 -0.5,-8; 38 0,-8; 39 0.5,-8; 40 1,-8; 41 1.5,-8; 42 2,-8; 43 2.5,-8; 44 3,-8; 45 3.5,-8; 46 4,-8; 47 4.5,-8; 48 5,-8; 49 5.5,-8; 50 6,-8; 76 6,8; 77 5.5,8; 78 5,8; 79 4.5,8; 80 4,8; 81 3.5,8; 82 3,8; 83 2.5,8; 84 2,8; 85 1.5,8; 86 1,8; 87 0.5,8; 88 0,8; 89 -0.5,8; 90 -1,8; 91 -1.5,8; 92 -2,8; 93 -2.5,8; 94 -3,8; 95 -3.5,8; 96 -4,8; 97 -4.5,8; 98 -5,8; 99 -5.5,8; 100 -6,8
LQFP48 = smd 0.241 x 1.016: 1 -2.75,-4.25; 2 -2.25,-4.25; 3 -1.75,-4.25; 4 -1.25,-4.25; 5 -0.75,-4.25; 6 -0.25,-4.25; 7 0.25,-4.25; 8 0.75,-4.25; 9 1.25,-4.25; 10 1.75,-4.25; 11 2.25,-4.25; 12 2.75,-4.25; 25 2.75,4.25; 26 2.25,4.25; 27 1.75,4.25; 28 1.25,4.25; 29 0.75,4.25; 30 0.25,4.25; 31 -0.25,4.25; 32 -0.75,4.25; 33 -1.25,4.25; 34 -1.75,4.25; 35 -2.25,4.25; 36 -2.75,4.25 | smd 1.016 x 0.241: 13 4.25,-2.75; 14 4.25,-2.25; 15 4.25,-1.75; 16 4.25,-1.25; 17 4.25,-0.75; 18 4.25,-0.25; 19 4.25,0.25; 20 4.25,0.75; 21 4.25,1.25; 22 4.25,1.75; 23 4.25,2.25; 24 4.25,2.75; 37 -4.25,2.75; 38 -4.25,2.25; 39 -4.25,1.75; 40 -4.25,1.25; 41 -4.25,0.75; 42 -4.25,0.25; 43 -4.25,-0.25; 44 -4.25,-0.75; 45 -4.25,-1.25; 46 -4.25,-1.75; 47 -4.25,-2.25; 48 -4.25,-2.75
1X03_254 = drill 1.016 pad 1.778 octagon: 1 -2.54,0; 2 0,0; 3 2.54,0
1X04_508_H = drill 1.397 pad 3.048 octagon: 1 0,0; 2 5.08,0; 3 10.16,0; 4 15.24,0
1X02_254 = drill 1.016 pad 1.778 octagon: 1 -1.27,0; 2 1.27,0
1X06 = drill 1.016 long: 1 -6.35,0; 2 -3.81,0; 3 -1.27,0; 4 1.27,0; 5 3.81,0; 6 6.35,0
1X04_254 = drill 1.016 pad 1.778 octagon: 1 -3.81,0; 2 -1.27,0; 3 1.27,0; 4 3.81,0
RJ45_TRAFO = drill 0.8 pad 1.5 octagon: 1 -5.715,8.89; 2 -4.445,6.35; 3 -3.175,8.89; 4 -1.905,6.35; 5 -0.635,8.89; 6 0.635,6.35; 7 1.905,8.89; 8 3.175,6.35; 9 4.445,8.89; 10 5.715,6.35 | drill 1 pad 1.5 octagon: A_G -6.325,-5.08; A_Y 3.785,-5.08; K_G -3.785,-3.38; K_Y 6.325,-3.38 | drill 1.6 pad 3.3: SH1 -8.255,3.15; SH2 8.255,3.15 | hole 3.2: -5.715,0; 5.715,0
J_P_2,1 = drill 2.54 pad 5 octagon: A 6.35,0; B 0,0 | drill 2.54 pad 3.81 long: BK 3.175,-5.08
0603 = smd 0.85 x 0.7: 1 -0.775,0; 2 0.775,0
WE-TPC_1028/1038 = smd 3.6 x 1.8: 1 0,4.5; 2 0,-4.5
SML0603 = smd 0.8 x 0.8: A 0.75,0; C -0.75,0
LED3MM = drill 0.813 octagon: A -1.27,0; K 1.27,0
HC49U-V = drill 0.813: 1 -2.413,0; 2 2.413,0
R0603 = smd 1 x 1.1: 1 -0.85,0; 2 0.85,0
SOIC127P600X175-8N = smd 1.981 x 0.559: 1 -2.464,1.905; 2 -2.464,0.635; 3 -2.464,-0.635; 4 -2.464,-1.905; 5 2.464,-1.905; 6 2.464,-0.635; 7 2.464,0.635; 8 2.464,1.905
SOIC127P620X175-8N = smd 1.981 x 0.559: 1 -2.464,1.905; 2 -2.464,0.635; 3 -2.464,-0.635; 4 -2.464,-1.905; 5 2.464,-1.905; 6 2.464,-0.635; 7 2.464,0.635; 8 2.464,1.905
SOIC127P600X175-14N = smd 1.981 x 0.508: 1 -2.464,3.81; 2 -2.464,2.54; 3 -2.464,1.27; 4 -2.464,0; 5 -2.464,-1.27; 6 -2.464,-2.54; 7 -2.464,-3.81; 8 2.464,-3.81; 9 2.464,-2.54; 10 2.464,-1.27; 11 2.464,0; 12 2.464,1.27; 13 2.464,2.54; 14 2.464,3.81
SOIC127P600X175-8N' = smd 2.184 x 0.559: 1 -2.362,1.905; 2 -2.362,0.635; 3 -2.362,-0.635; 4 -2.362,-1.905; 5 2.362,-1.905; 6 2.362,-0.635; 7 2.362,0.635; 8 2.362,1.905

### Placement (x,y rotation side)
C1  24.89,15.49 90 top
C2  28.45,31.62 90 top
C3  48.51,30.73 0 top
C4  27.3,9.53 180 top
C5  48.51,17.27 0 top
C6  37.47,5.84 90 top
C7  49.78,28.19 0 top
C8  26.67,34.42 180 top
C9  40.51,4.7 180 top
C10  41.27,6.6 0 top
C11  80.39,22.99 0 top
C12  70.36,11.43 270 top
C13  74.3,26.29 270 top
C14  76.07,25.78 270 top
C15  64.01,17.02 180 top
C16  64.64,15.11 180 top
C17  85.47,37.47 180 top
C18  85.47,43.56 180 top
C19  83.19,26.16 270 top
C20  51.69,30.73 180 top
C21  60.58,34.67 180 top
C22  79.76,26.16 270 top
C23  77.85,25.78 270 top
C24  35.43,5.84 270 top
C25  17.65,47.12 180 top
C26  19.68,17.91 270 top
C27  52.45,55.88 180 top
C28  73.91,57.4 180 top
C29  52.83,74.8 180 top
C32  36.45,53.72 0 top
C33  40.89,53.98 0 top
C34  43.43,41.66 270 top
C35  41.66,8.64 180 top
C36  42.55,10.41 0 top
C37  27.3,11.56 0 top
C38  74.8,74.8 180 top
C39  23.5,8.51 90 top
C40  34.29,2.79 0 top
D1  52.83,70.23 0 top
D2  74.17,70.99 0 top
IC1  35.81,21.84 90 top
IC2  69.72,21.34 180 top
JP1  22.23,18.8 90 top
JP2  7.37,49.76 90 bottom
JP3  14.61,57.91 0 top
JP4  7.37,15 90 bottom
JP5  14.61,22.35 0 top
JP7  22.1,31.62 90 top
JP8  13.97,4.95 180 top
K1  89.03,38.35 270 bottom
K2  90.04,60.33 180 top
L1  81.41,26.29 270 top
L2  83.57,22.99 0 top
L3  43.69,64.14 270 top
L4  65.02,64.77 270 top
LED1  54.23,53.21 180 top
LED2  75.69,54.86 180 top
LED3  12.45,50.67 270 top
LED4  12.45,29.46 90 top
LED5  63.63,40 180 top
Q1  59.05,30.73 0 top
Q2  26.16,4.06 180 top
R1  48.51,23.24 270 top
R2  46.48,23.24 270 top
R3  33.4,5.84 270 top
R4  71.25,8.76 180 top
R5  55.12,17.27 180 top
R6  55.12,19.3 180 top
R7  55.12,21.34 180 top
R8  55.12,23.37 180 top
R9  64.9,10.54 180 top
R10  67.69,9.65 270 top
R11  64.9,12.57 180 top
R12  78.87,18.16 270 top
R13  76.83,18.16 270 top
R14  44.32,30.61 90 top
R15  80.39,20.95 0 top
R16  85.47,41.53 0 top
R17  85.47,35.43 0 top
R18  85.47,33.4 0 top
R19  85.47,39.5 0 top
R20  59.18,25.27 180 top
R21  93.22,47.62 0 top
R22  93.34,29.08 0 top
R23  55.12,25.4 0 top
R24  14.35,40.13 180 top
R25  14.35,38.1 180 top
R26  14.35,42.16 0 top
R27  10.79,58.29 270 top
R28  13.72,9.78 180 top
R29  13.72,13.84 180 top
R30  50.8,58.67 180 top
R31  13.72,11.81 0 top
R32  10.92,22.86 90 top
R33  54.1,58.67 180 top
R34  73.53,60.07 180 top
R35  76.58,60.07 180 top
R37  18.16,27.69 180 top
R38  18.16,32.89 0 top
R41  18.16,38.1 0 top
R42  18.29,25.15 0 top
R43  50.8,53.21 180 top
R44  72.26,54.74 180 top
R45  10.92,46.99 270 top
R46  12.95,25.78 0 top
R47  67.56,40.77 90 top
R48  23.37,55.63 180 top
R49  23.37,51.69 180 top
R50  28.45,46.35 270 top
R51  28.45,41.78 270 top
R52  34.92,46.35 270 top
R53  34.92,41.78 270 top
R54  28.7,59.56 0 top
R55  32.13,59.56 0 top
R56  36.45,51.69 0 top
R57  36.45,55.75 0 top
R58  32.77,46.35 270 top
R59  32.77,41.78 270 top
R60  39.5,41.66 270 top
R61  41.4,41.66 270 top
R62  42.67,38.35 180 top
R63  30.61,46.35 270 top
R64  30.61,41.78 270 top
U1  17.53,52.2 90 top
U2  14.73,17.91 180 top
U3  52.96,64.14 90 top
U4  74.55,65.15 90 top
U5  30.23,53.72 180 top
U6  MCP602-E/SN  [SOIC127P600X175-8N']  41.91,48.51 90 top

### Tracks (layer width: path | path; a pad name or v marks a point on that pad's centre or on a via)
+3V3  (via drill 0.6)
  Top 0.254: IC2.25 66.97,15.94
  Top 0.305: R21.1 92.46,47.54 92.46,44.2 93.6,43.05 93.6,41.53 92.96,40.89 92.96,33.66 93.6,33.02 93.6,31.5 92.5,30.39 R22.1 92.5,27.47 v89.66,24.64 89.66,24.38 | 40.81,10.18 C36.+ 40.31,11.14 IC1.22 40.31,11.12 41.02,10.41 41.02,8.85 | IC1.21 39.81,6.6 | 39.81,6.6 39.81,4.85 C9.2 39.66,3.85 39.62,3.81 | C10.+ 39.81,6.6 | 41.02,8.85 C35.2 | 41.02,8.85 41.02,5.97 40.51,5.46 40.51,3.81 39.62,3.81 | C6.2 37.5,6.69 37.59,6.6 | 37.59,6.6 38.61,6.6 38.61,3.81 | IC1.11 34.8,13.83 34.8,12.95 33.78,11.94 33.78,10.92 32.38,9.53 C4.1 28.16,7.53 | IC1.100 26.09,15.84 C1.1 | R1.1 50.04,24.09 | 50.04,24.09 52.96,24.09 R23.1 52.87,26.8 v52.83,26.8 | 66.97,15.94 C16.+ 64.86,16.4 C15.1 v66.04,17.02 | 71.41,57.38 C28.+ | IC1.6 32.31,12.25 31.88,11.81 28.41,11.81 | 28.41,11.81 C37.2 | 28.41,11.81 27.94,11.81 27.3,11.18 | 27.3,7.62 27.3,7.49 v25.78,7.49 | 28.16,7.53 28.19,7.49 | 85.98,20.95 R15.2 | 39.62,3.81 39.5,3.81 38.61,3.81 | C6.2 37.47,6.6 37.59,6.6 | R3.2 33.4,3.94 38.48,3.94 38.61,3.81 | IC1.75 29.81,30.7 29.84,30.73 28.49,30.73 C2.1 28.11,30.77 v27.05,29.72 | R41.1 17.31,36.07 | 17.31,36.07 R38.1 17.31,30.9 15.37,28.96 15.37,26.04 15.62,25.78 | 15.62,25.78 16.26,25.15 R42.1 17.44,24.22 20.32,21.34 | 20.32,21.34 JP1.3 23.88,21.34 24.51,21.97 v24.51,25.15 | 27.3,11.18 27.3,12.83 25.53,14.61 24.93,14.61 C1.1 | U2.3 19.47,18.54 C26.1 | C26.1 19.68,20.7 20.32,21.34 | R29.1 14.73,14.01 14.73,17.4 15.88,18.54 U2.3 | R46.2 15.62,25.78 | U1.3 18.16,47.46 | 18.16,47.46 C25.1 | R41.1 R25.1 | R14.2 44.41,31.37 44.96,31.37 45.85,30.48 v46.23,30.48 47.88,30.48 47.66,30.27 C3.1 47.62,30.7 47.62,30.1 45.37,27.84 IC1.50 | L1.2 v81.41,24.51
  Top 0.305: IC1.28 47.58,16.84 C5.1 | IC1.28 47.2,16.84 47.62,17.27 47.62,18.16 50.29,18.16 v50.8,17.65 | v50.04,23.37 50.04,24.09 | 28.16,7.53 27.39,7.53 27.3,7.62 | 71.25,52.07 71.25,45.3 R47.2 | JP8.1 17.65,5.08 17.65,4.95 20.32,2.29 | C1.1 24.89,14.61 | 27.3,11.18 27.3,7.62 | C26.1 19.68,18.54 U2.3 | 20.32,2.29 9.02,2.29 8.38,2.92 8.38,9.02 3.94,13.46 3.94,25.53 5.97,27.56 9.14,27.56 10.41,28.83 10.41,32.64 10.54,32.77 | 20.32,2.29 20.45,2.16 | R45.2 10.92,36.32 11.3,35.94 17.18,35.94 17.31,36.07 | 18.16,47.46 18.16,45.97 v18.8,45.34 | v18.8,43.05 18.8,39.59 R41.1 | v80.01,12.45 82.04,12.45 82.3,12.19 | IC1.28 44.15,16.84 | IC1.19 38.81,9.22 37.85,8.26 37.85,7.07 C6.2
  Top 0.406: 39.62,2.92 39.62,3.05 39.5,3.17 39.5,3.81 | 85.98,20.95 86.23,20.95 88.27,18.92 | 10.54,32.77 10.54,35.18 11.3,35.94
  Top 0.61: L4.2 60.52,64.32 64.77,60.07 71.37,60.07 | R34.2 71.37,60.07 | 71.37,60.07 71.37,57.42 C28.+ | R44.2 71.41,57.38 | 40.39,2.16 39.62,2.92 | 89.66,24.38 91.69,22.35 | 20.45,2.16 21.21,1.52 39.5,1.52 40.51,2.16
  Top 0.813: 92.96,52.07 95.5,49.15 95.5,26.29 91.69,22.35 88.27,18.92 82.3,12.95 82.3,12.19
  Top 1.016: R44.2 71.41,52.24 71.25,52.07 92.96,52.07 | 82.3,12.19 82.3,8.26 76.2,2.16 40.51,2.16 40.39,2.16
  Bottom 0.305: v46.23,30.48 49.15,30.48 v52.83,26.8 62.61,17.02 v66.04,17.02 75.44,17.02 v80.01,12.45 | 89.53,24.51 v89.66,24.64 | v50.8,17.65 50.8,22.61 v50.04,23.37 | v25.78,7.49 20.32,7.49 JP8.1 | v27.05,29.72 25.65,28.32 25.65,26.29 v24.51,25.15 | v18.8,45.34 v18.8,43.05
  Bottom 0.406: v81.41,24.51 89.53,24.51
ADC_CAN1DIFF  (via drill 0.6)
  Top 0.254: IC1.15 36.81,21.73 34.92,23.62 v34.92,26.8
  Top 0.305: R64.1 30.61,44.07 | 30.61,44.07 R63.2 | v31.75,44.07 30.61,44.07
  Bottom 0.254: v34.92,26.8 34.92,35.94
  Bottom 0.305: 34.92,35.94 31.75,39.12 v31.75,44.07
ADC_CAN1H  (via drill 0.6)
  Top 0.305: IC1.30 45.91,17.84 v45.97,17.91 | v36.45,44.07 34.92,44.07 R53.1 R52.2
  Bottom 0.305: v45.97,17.91 44.2,17.91 42.67,19.43 42.67,30.86 43.18,31.37 43.18,32.26 36.58,38.86 36.58,43.94 v36.45,44.07
ADC_CAN1L  (via drill 0.6)
  Top 0.254: IC1.29 42.6,17.34 v39.12,20.83 | v29.46,44.07 28.45,44.07
  Top 0.305: R50.2 28.45,44.07 R51.1
  Bottom 0.254: v39.12,20.83 33.66,26.29 33.66,35.31 29.46,39.5 v29.46,44.07
ADC_TRIG  (via drill 0.6)
  Top 0.305: R58.2 32.77,44.07 | 32.77,44.07 R59.1 | v34.04,39.24 35.81,37.47 IC1.63 35.81,27.05 v37.21,25.65 | v33.53,44.07 32.77,44.07 | v39.75,23.11 41.78,23.11 | IC1.40 42.05,22.84 | 42.05,22.84 41.78,23.11 | IC1.42 42.51,23.84 41.78,23.11 | IC1.31 42.49,18.34 42.04,18.8 42.04,22.83 42.05,22.84
  Bottom 0.305: v34.04,39.24 34.04,43.56 v33.53,44.07 | v37.21,25.65 v39.75,23.11
ADC_TRIG_VALUE_PWM
  Top 0.305: IC1.59 37.81,36.04 40.13,38.35 R62.2
CAN1_H
  Top 0.305: 16.64,56.01 16.89,55.75 U1.7 16.76,54.53 16.76,52.96 18.03,51.69 R49.2 | 16.64,56.01 8.53,56.01 JP2.2 | JP3.2 16,57.91 16.64,57.28 16.64,56.01
CAN1_L
  Top 0.305: JP2.3 10.79,59.92 | 10.79,59.92 16.15,59.92 18.16,57.91 18.16,56.26 | 18.16,56.26 U1.6 | R27.1 10.79,59.92 | R48.2 22.48,55.63 21.84,56.26 18.16,56.26
CAN1_MODE  (via drill 0.6)
  Top 0.254: IC1.67 33.78,29.88 33.78,33.91 v30.48,37.08
  Top 0.305: R24.1 v17.14,40.13
  Bottom 0.254: v30.48,37.08 27.43,40.13
  Bottom 0.305: v17.14,40.13 27.43,40.13
CAN1_RX
  Top 0.305: IC1.70 32.32,29.84 32.32,33.91 19.56,46.61 19.56,49.61 U1.4
CAN1_TX
  Top 0.305: IC1.71 31.81,33.72 21.34,44.07 16.76,44.07 15.49,45.34 15.49,49.61 U1.1
CAN2_MODE  (via drill 0.6)
  Top 0.305: IC1.96 25.59,17.84 v25.53,17.78 | v17.4,9.78 R28.1
  Bottom 0.305: v25.53,17.78 21.21,13.46 21.08,13.46 v17.4,9.78
CAN2_RX  (via drill 0.6)
  Top 0.305: v18.54,21.08 18.54,19.94 18.41,19.81 U2.4 | IC1.91 26.39,20.34 25.91,20.83 v24.77,20.83
  Bottom 0.305: v18.54,21.08 19.56,20.07 24,20.07 v24.77,20.83
CAN2_TX  (via drill 0.6)
  Top 0.305: IC1.92 25.94,19.84 v25.65,19.56 | v18.92,15.37 18.67,15.37 18.03,16 U2.1
  Bottom 0.305: v18.92,15.37 21.08,17.53 23.62,17.53 v25.65,19.56
CANL
  Top 0.305: U2.6 11.3,18.54 9.78,20.07 9.78,22.61 | 9.78,22.61 9.78,22.75 JP4.3 | R32.1 10.38,22.01 9.78,22.61
ETH_INTRP  (via drill 0.6)
  Top 0.254: IC2.32 70.47,14.49 | v44.32,33.53 40.51,33.53 40.01,33.02
  Top 0.305: 70.47,14.49 v70.99,13.97 | IC1.54 40.31,31.57 40.01,31.88 40.01,33.02 | R14.1 44.32,29.08 v44.7,28.7
  Bottom 0.254: 44.32,30.73 v44.32,33.53
  Bottom 0.305: v70.99,13.97 63.25,13.97 48.9,28.32 46.23,28.32 45.4,29.15 | 45.4,29.15 44.32,30.23 44.32,30.73 | v44.7,28.7 44.96,28.7 45.4,29.15
ETH_MDC  (via drill 0.6)
  Top 0.254: IC2.19 60.83,21.09
  Top 0.305: v36.32,9.53 36.32,10.03 37.21,10.92 37.21,11.3 37.31,11.41 IC1.16 37.31,23.47 43.18,29.34 43.18,31.88 43.69,32.38 v47.37,32.38 | 60.71,21.21 v60.45,21.46 60.83,21.09
  Bottom 0.305: v60.45,21.46 49.47,32.45 49.4,32.38 v47.37,32.38
ETH_MDIO
  Top 0.254: IC2.18 62.49,21.59
  Top 0.305: 62.49,21.59 60.71,23.37 58,23.37 R23.2 55.12,24.55 55.12,16.38 52.58,13.84 IC1.25
ETH_MII_COL  (via drill 0.6)
  Top 0.305: R13.2 v76.83,11.18 | IC1.26 52.67,15.84 v52.7,15.88
  Bottom 0.305: v76.83,11.18 61.21,11.18 56.52,15.88 v52.7,15.88
ETH_MII_CRS  (via drill 0.6)
  Top 0.305: v78.74,8.89 78.74,17.18 R12.2 | IC1.23 40.81,11.89 41.15,11.56 45.59,11.56 v45.85,11.3
  Bottom 0.305: v78.74,8.89 75.18,5.33 52.2,5.33 46.35,11.18 45.97,11.18 v45.85,11.3
ETH_MII_RX_CLK
  Top 0.305: IC1.24 41.31,12.79 41.78,12.32 58.55,12.32 60.33,10.54 R9.2
ETH_MII_RX_DV  (via drill 0.6)
  Top 0.305: R11.2 61.21,12.57 v60.33,13.46 | IC1.32 51.51,18.84 v52.07,18.29
  Bottom 0.305: v52.07,18.29 55.5,18.29 v60.33,13.46
ETH_MII_RX_ER  (via drill 0.6)
  Top 0.305: R10.2 59.78,8.8 v57.28,11.3 | IC1.47 45.28,26.34 v45.85,25.78
  Bottom 0.305: v57.28,11.3 55.5,11.3 45.85,20.95 v45.85,25.78
ETH_MII_RXD0
  Top 0.305: IC1.33 52.2,19.34 R5.2
ETH_MII_RXD1
  Top 0.305: IC1.34 53.73,19.84 R6.2
ETH_MII_RXD2
  Top 0.305: IC1.35 49.3,20.34 50.29,21.34 R7.2
ETH_MII_RXD3
  Top 0.305: IC1.36 48.91,20.84 51.44,23.37 R8.2
ETH_MII_TX_CLK  (via drill 0.6)
  Top 0.305: R4.2 70.4,4.1 v70.36,4.06 | 37.97,9.53 v37.72,9.53 38.31,10.12 IC1.18
  Bottom 0.305: v70.36,4.06 52.32,4.06 46.86,9.53 v37.72,9.53
ETH_MII_TX_EN  (via drill 0.6)
  Top 0.254: IC2.34 71.47,15.52
  Top 0.305: 71.47,15.52 72.77,14.22 72.77,12.45 v72.9,12.32 | 48.26,26.8 48.39,26.67 v48.51,26.67 48.34,26.84 IC1.48
  Bottom 0.305: v72.9,12.32 62.87,12.32 v48.51,26.67
ETH_MII_TXD0  (via drill 0.6)
  Top 0.254: IC2.35 71.97,15.91
  Top 0.305: 71.97,15.91 73.79,14.1 73.79,10.41 v73.53,10.16 | IC1.51 41.81,31.65 v42.16,32
  Bottom 0.305: v73.53,10.16 51.18,10.16 41.78,19.56 41.78,31.62 v42.16,32
ETH_MII_TXD1  (via drill 0.6)
  Top 0.254: IC2.36 72.47,16.3
  Top 0.305: 72.47,16.3 74.42,14.35 74.42,9.4 v74.04,9.02 | IC1.52 41.31,32.09 v41.02,32.38
  Bottom 0.305: v41.02,32.38 41.15,32.26 41.15,19.3 51.44,9.02 v74.04,9.02
ETH_MII_TXD2  (via drill 0.6)
  Top 0.254: IC2.38 74.89,19.09 75.06,18.92
  Top 0.305: IC1.17 37.81,13.37 37.85,16.76 37.85,17.4 v39.24,18.8 | 75.06,18.92 75.06,8 v74.8,7.75
  Bottom 0.305: v39.24,18.8 40.77,18.8 51.82,7.75 v74.8,7.75
ETH_MII_TXD3  (via drill 0.6)
  Top 0.254: IC2.39 75.16,19.59
  Top 0.305: 75.16,19.59 75.69,19.05 75.69,7.24 74.93,6.48 v74.04,6.48 | v32.26,17.65 30.99,17.65 29.78,16.51 29.78,13.88 IC1.1
  Bottom 0.305: v32.26,17.65 32.38,17.53 41.02,17.53 52.07,6.48 v74.04,6.48
ETH_RST  (via drill 0.6)
  Top 0.254: IC2.47 74.71,23.59 | 40.01,34.54 v45.47,34.54
  Top 0.305: 75.31,22.99 C11.1 R15.1 | 74.71,23.59 75.31,22.99 | 75.31,22.99 75.31,22.61 v75.18,22.48 | IC1.55 39.81,31.05 39.37,31.5 39.37,33.91 40.01,34.54
  Bottom 0.254: v45.47,34.54 49.28,34.54
  Bottom 0.305: v75.18,22.48 61.34,22.48 49.28,34.54
EXTSUPPLY
  Top 0.61: U4.7 73.91,68.83 74.3,69.22 74.3,73.28 72.96,74.61 72.77,74.8 C38.+ | U3.7 52.32,67.69 52.83,68.2 52.83,74.3 52.32,74.8 C29.+
  Top 1.016: 72.64,77.6 50.42,77.6 | 50.42,77.6 50.29,77.6 | 50.29,77.6 50.29,77.47 | C29.+ 50.29,74.82 50.29,77.47 | K2.A 83.57,60.33 81.03,62.87 81.03,76.33 79.76,77.6 72.64,77.6 | 72.64,77.6 72.64,74.93 72.96,74.61 | 50.29,77.47 50.42,77.6 | 50.29,77.6 12.7,77.6 2.79,67.69 2.79,65.28 | 2.79,65.28 2.79,34.81 JP4.4 | JP2.4 3.07,65 2.79,65.28
GND  (via drill 0.6)  (1 unrouted)
  Top 0.254: IC2.3 IC2.2 | 69.47,18.41 IC2.30 69.47,11.46 | 65.52,18.54 IC2.24 67.01,18.59 | 66.93,22.1 65.48,22.1 IC2.17 | 63.92,17.82 64.64,18.54 65.43,18.54 | 41.44,40.81 R61.2 41.27,40.51 | 37.47,39.75 36.11,39.75 R53.2
  Top 0.305: IC2.37 73.7,18.59 73.66,18.54 72.64,18.54 72.26,18.92 72.26,20.45 | 72.26,20.45 72.26,24.38 72.01,24.64 72.01,25.55 | 72.01,25.55 IC2.2 | 72.01,25.55 72.44,25.55 IC2.1 74.15,25.59 C13.2 74.92,25.44 C14.- C23.- 79.76,24.28 | 69.47,18.41 69.34,18.54 68.33,18.54 | 68.33,18.54 67.06,18.54 | 67.06,18.54 65.52,18.54 | 67.01,18.59 67.06,18.54 | 67.06,18.54 67.06,22.1 66.93,22.1 67.06,22.23 67.06,24.13 67.01,24.09 IC2.13 65.47,26.98 v65.41,27.05 | 86.49,43.43 C18.1 86.58,43.6 85.72,44.45 84.58,44.45 83.57,45.47 v83.57,49.91 | C7.- 51.41,28.32 56.39,28.32 58.33,26.38 R20.2 58.33,26.71 v58.67,27.05 | C36.- 44.05,10.18 C35.1 | C9.1 42.55,5.88 42.55,6.6 C10.- 42.51,6.87 C35.1 | C24.2 C6.1 36.49,4.99 36.45,4.95 v36.45,8.13 | IC1.99 C1.2 24.8,16.26 JP1.1 | IC1.99 | R2.1 46.82,24.09 47.75,25.02 48.9,25.02 51.31,27.43 51.31,28.17 C7.- | 72.26,20.45 v71.37,20.45 | v68.45,20.45 68.45,18.67 68.33,18.54 | 65.43,18.54 IC2.24 | 69.47,11.46 C12.2 | 63.92,17.82 63.92,17.78 C15.2 63.16,15.13 C16.- | LED2.C C28.- | R53.2 R59.2 R64.2 R51.2 27.14,40.93 v25.53,42.55 | R57.2 C32.2 38.35,53.72 v38.73,53.34 | C4.2 C37.1 24.42,13.59 23.24,13.59 | JP1.1 22.23,14.61 23.24,13.59 | C39.2 23.5,13.34 23.24,13.59 | 79.76,24.28 79.95,24.28 C11.2 L2.1 | C22.2 79.76,24.28 | C3.2 C20.2 50.84,28.64 C7.- | IC1.74 30.31,31.92 29.76,32.47 C2.2 27.9,32.47 27.5,32.07 | 54.98,58.65 R33.1 | 27.5,32.07 v26.67,31.24 | v17.02,29.34 17.02,28.11 R37.2 | JP1.1 21.42,17.06 C26.2 19.47,17.27 U2.2 17.07,17.14 16.13,17.14 15.49,16.51 15.49,13.72 | IC1.20 39.31,8.33 v38.99,8 | v43.94,8.26 42.89,8.26 C35.1 | C40.2 v36.45,2.79 | U1.2 16.8,49.65 C25.2 16.8,45.43 v17.14,45.09
  Top 0.305: C8.- 25.17,34.39 27.5,32.07 | v17.14,42.16 R26.2 | C5.2 49.4,17.23 49.4,16.64 49.11,16.34 IC1.27 40.22,16.34 v40.13,16.26 39.37,15.49 | 39.37,15.49 39.31,15.42 IC1.20 | IC1.20 39.31,15.44 39.37,15.49 | v34.29,16.26 34.29,15.14 IC1.10 | 83.57,56.39 83.19,56.77 | R31.2 14.86,11.81 15.49,12.45 15.49,13.72 | 15.49,13.72 v17.27,13.72 | C33.2 44.96,53.98 45.47,53.47 45.47,51.69 | 45.47,51.69 45.47,46.28 45.34,46.15 | U5.11 v25.78,53.72 | v46.86,51.82 45.59,51.82 45.47,51.69 | C21.2 59.73,35.73 v60.71,36.7 | C34.2 41.44,40.81 40.39,39.75 37.47,39.75 37.47,42.8 v37.72,43.05 | v51.82,47.24 51.69,47.24 50.8,48.13
  Top 0.61: U4.5 76.45,70.91 D2.A 76.37,71.03 76.45,71.12 76.45,73.93 C38.- | U4.6 U4.5 | C28.- 77.43,58.4 R35.1 77.43,66.64 U4.5 | U3.5 U3.6 | U3.5 54.86,70.06 D1.A 55.03,74.48 C29.- | U3.5 54.94,66.6 55.88,65.66 55.88,59.6 R33.1 | 54.98,58.65 C27.- LED1.C 54.99,52.32 50.8,48.13 48.82,46.15 45.34,46.15 U6.4
  Top 1.016: C8.- 25.17,38.2 v21.34,42.04 | K2.B 90.04,59.69 87.12,56.77 83.19,56.77 77.07,56.77 C28.- | C27.- 54.98,56.88 54.99,56.9 v59.31,56.9
  Bottom 0.305: v71.37,20.45 v68.45,20.45 | JP7.3 18.03,30.35 v17.02,29.34 | v43.94,8.26 43.69,8 v38.99,8 38.86,8.13 v36.45,8.13 v36.45,2.79 | v17.14,45.09 v17.14,42.16 | v25.53,42.55 21.84,42.55 v21.34,42.04 | v40.13,16.26 v34.29,16.26 | v17.27,13.72 7.38,13.72 | 7.38,13.72 JP4.1 | JP8.4 10.16,7.37 8.64,8.89 8.64,13.7 7.38,13.72 | v25.78,53.72 29.46,53.72 30.1,53.09 38.48,53.09 v38.73,53.34 45.34,53.34 v46.86,51.82 | 61.53,37.53 65.41,33.66 v65.41,27.05 v58.67,27.05 | 61.53,37.53 59.82,39.24 59.82,56.39 v59.31,56.9 | v60.71,36.7 61.53,37.53 | v37.72,43.05 43.94,42.93 v51.82,47.24 | v83.57,49.91 83.57,56.77 83.69,56.9
  Bottom 0.406: 9.27,49.78 7.37,49.78 2.54,49.78 | 2.54,15 JP4.1
  Bottom 0.61: v36.45,2.79 36.45,1.52 12.06,1.52 10.16,3.3 JP8.4 | JP2.1 7.37,49.78 | 9.27,49.78 9.27,53.34 14.61,53.34 17.14,50.8 v17.14,45.09
  Bottom 0.813: 2.54,49.78 2.54,15
  Bottom 1.016: v21.34,42.04 18.8,41.4 v17.14,42.16 | v59.31,56.9 83.69,56.9 87.25,56.9 90.04,59.69 K2.B
  pour Bottom (isolate 0.305, rank 2): 0.64,79.25 96.14,79.25 96.14,0.64 0.64,0.64
JTG-TCK/SWCLK
  Top 0.305: R37.1 21.97,27.69 JP7.2 22.16,27.88 28.23,27.88 IC1.76
JTG-TDO/SWO
  Top 0.305: R41.2 19.14,37.97 JP7.6 19.05,37.97 19.05,35.43 18.16,34.54 18.16,26.54 24.51,26.54 25.4,25.65 25.4,22.23 26.28,21.34 IC1.89
JTG-TMS/SWDIO  (via drill 0.6)
  Top 0.305: JP7.4 R38.2 | IC1.72 31.31,32.95 v30.61,33.66
  Bottom 0.305: JP7.4 22.23,33.02 29.97,33.02 v30.61,33.66
LED_CAN1  (via drill 0.6)
  Top 0.254: IC1.83 26.58,24.34 v26.29,24.64
  Bottom 0.254: v26.29,24.64 25.27,24.64 24.51,23.88 20.57,23.88 14.73,29.72 14.73,29.84 12.19,32.38 12.19,49.15 LED3.K
LED_CAN2  (via drill 0.6)
  Top 0.254: v26.29,23.37 27.79,23.37 IC1.85
  Bottom 0.254: LED4.K 12.57,30.73 19.94,23.37 v26.29,23.37
LED_GLOBAL
  Top 0.254: IC1.57 38.81,34.24 40.51,35.94 46.23,35.94 47.88,34.29 56.64,34.29 57.66,35.31 LED5.K
N$1
  Top 0.305: 22.27,18.84 JP1.2 22.35,18.67 26.29,18.67 26.46,18.84 IC1.94
N$2
  Top 0.305: IC1.49 43.81,27.37 47.46,27.37 C7.+
N$4
  Top 0.305: IC1.73 30.81,29.77 30.8,29.72 30.8,32.13 28.83,34.16 C8.+
N$5
  Top 0.305: R27.2 12.87,57.44 JP3.1
N$6
  Top 0.305: IC1.37 45.44,21.34 R2.2 R1.2
N$7
  Top 0.61: D1.C 51.05,69.81 U3.8 49.2,66.6 48.26,65.66 48.26,64.21 L3.1
N$9
  Top 0.305: L1.1 81.36,27.01 C22.1 78.12,27.01 C23.+ 77.85,28.19 77.47,28.57 71.25,28.57 69.47,26.8 IC2.7
N$10
  Top 0.254: IC2.33 70.97,15.13
  Top 0.305: 70.97,15.13 72.01,14.1 72.01,8.85 R4.1
N$12
  Top 0.305: U1.8 15.62,51.94 14.86,51.18 14.86,43.52 R26.1 R24.2 R25.2
N$14
  Top 0.305: JP4.2 7.37,19.18 9.27,17.27 U2.7 12.39,17.4 13.46,17.4 14.86,18.8 14.86,21.34 JP5.2
N$16
  Top 0.254: IC2.28 68.47,13.27
  Top 0.305: 68.47,13.27 R9.1
N$17
  Top 0.305: 12.83,13.84 12.83,11.85 R31.1 R28.2 | R29.2 12.83,13.84 | 12.83,13.84 12.83,13.97 12.19,14.61 12.19,15.93 U2.8
N$18
  Top 0.254: IC2.23 57.78,19.09
  Top 0.305: 57.78,19.09 R5.1
N$19
  Top 0.254: IC2.22 56.25,19.59
  Top 0.305: 56.25,19.59 R6.1
N$20
  Top 0.254: 57.78,20.07 65.45,20.07 IC2.21
  Top 0.305: 57.78,20.07 56.52,21.34 R7.1
N$21
  Top 0.254: IC2.20 59.42,20.59
  Top 0.305: 59.42,20.59 56.64,23.37 R8.1
N$22
  Top 0.254: IC2.29 68.97,12.84
  Top 0.305: 68.97,12.84 67.69,11.56 R10.1
N$23
  Top 0.254: IC2.27 67.97,13.74
  Top 0.305: 67.97,13.74 67.06,12.83 66,12.83 R11.1
N$24
  Top 0.254: IC2.41 77.29,20.59
  Top 0.305: 77.29,20.59 R12.1
N$25
  Top 0.254: IC2.40 75.76,20.09
  Top 0.305: 75.76,20.09 R13.1
N$26
  Top 0.305: R32.2 11.98,23.71 JP5.1
N$27
  Top 0.305: JP7.1 19.27,25.27 R42.2
N$28
  Top 0.61: D2.C 72.64,70.32 U4.8 71.04,67.61 69.47,66.04 69.47,64.83 L4.1
N$29
  Top 0.61: U4.4 76.45,61.47 75.95,60.96 75.95,60.29 R35.2 R34.1
N$30
  Top 0.305: U3.4 54.86,60.83 53.34,59.31 53.34,58.76 R33.2 R30.1
N$35
  Top 0.305: R43.1 LED1.A
N$36
  Top 0.254: 69.98,12.7 IC2.31
  Top 0.305: IC2.4 70.97,25.04 70.99,25.02 | 70.99,25.02 70.99,22.35 69.98,21.34 IC2.31 | C12.1 70.52,12.15 69.98,12.7 | 70.99,25.02 70.99,26.29 71.63,26.92 74.08,26.92 C13.1 75.93,27.14 C14.+
N$37
  Top 0.254: IC2.9 68.47,29.23
  Top 0.305: 68.47,29.23 74.42,35.18 K1.8
N$38
  Top 0.254: IC2.10 67.97,29.49
  Top 0.305: 67.97,29.49 74.93,36.45 K1.7
N$39
  Top 0.254: IC2.11 67.47,33.44
  Top 0.305: 67.47,33.44 76.83,42.8 K1.2
N$40
  Top 0.254: IC2.12 66.97,33.83
  Top 0.305: 66.97,33.83 77.34,44.2 80.01,44.2 K1.1
N$41
  Top 0.406: K1.4 82.93,40.26 83.06,40.39 83.86,40.39 R16.1
N$42
  Top 0.406: K1.9 80.39,33.91 80.39,33.78 83.22,33.78 R17.1
N$43
  Top 0.305: K1.10 83.19,32.64 83.95,33.4 R18.1
N$44
  Top 0.406: K1.5 84.37,38.99 R19.1
N$45
  Top 0.254: R19.2 86.32,39.41 87.38,38.35 87.38,36.49 R17.2
  Top 0.305: R18.2 86.58,33.36 85.47,32.26 84.71,32.26 83.69,31.24 83.69,28.22 C19.1
  Top 0.406: R16.2 R19.2 | R17.2 R18.2
N$46
  Top 0.406: K1.6 84.62,37.72 C17.2
N$47
  Top 0.254: 84.71,43.27 84.71,43.18 83.06,41.53 K1.3
  Top 0.305: 84.71,43.27 C18.2
N$48
  Top 0.305: 84.33,23 L2.2 83.19,24.14 C19.2 85.57,24.74 85.85,25.02 85.85,30.07 K1.SH2
  Bottom 1.016: K1.SH1 K1.SH2
N$49
  Top 0.305: IC2.16 62.72,22.59 R20.1
N$50  (via drill 0.6)
  Top 0.254: IC2.42 74.29,21.09 74.3,21.08 77.47,21.08 v77.72,21.34
  Top 0.305: v86.61,22.48 86.61,24.51 89.15,27.05 89.15,29.34 91.31,31.5 91.31,32.64 92.2,33.4 92.2,41.93 K1.K_G
  Bottom 0.254: 85.6,21.46 77.85,21.46 v77.72,21.34
  Bottom 0.305: 85.6,21.46 v86.61,22.48
N$51  (via drill 0.6)
  Top 0.254: IC2.43 75.94,21.59 v76.45,22.1
  Top 0.305: 92.41,31.83 K1.K_Y 92.33,31.95 92.33,31.37 90.55,29.59 90.55,27.05 88.14,24.77 v88.14,23.62
  Bottom 0.254: v88.14,23.62 86.36,23.62 84.96,22.23 76.58,22.23 v76.45,22.1
N$52
  Top 0.305: R22.2 94.19,34.48 K1.A_Y
N$53
  Top 0.305: K1.A_G 94.11,47.59 R21.2
N$54
  Top 0.305: LED2.A 73.24,54.86 R44.1
N$55  (1 unrouted)
  Top 0.305: IC2.14 64.68,23.59 61.47,26.8 Q1.2 61.47,34
N$56
  Top 0.305: IC2.15 64.29,23.09 Q1.1 C20.1
N$57
  Top 0.305: R45.1 10.92,50.42 LED3.A
N$58
  Top 0.305: R46.1 12.1,27.85 LED4.A
N$59
  Top 0.254: LED5.A 67.48,40 R47.1
N$60  (via drill 0.6)
  Top 0.305: U5.13 U5.14 27.76,50.47 27.69,50.55 v25.78,50.55 | R52.1 v34.92,49.02 34.92,51.31 35.31,51.69 R56.1
  Bottom 0.305: v25.78,50.55 34.92,50.55 v34.92,49.02
N$61
  Top 0.305: R50.1 28.45,47.75 29.72,49.02 29.72,55.63 29.08,56.26 U5.9 27.69,56.34 27.69,57.4 27.76,57.48 U5.8 27.76,59.47 R54.1
N$62
  Top 0.305: U5.12 24.98,52.45 R49.1
N$63
  Top 0.305: U5.10 24.85,54.99 R48.1
N$65
  Top 0.305: U5.7 31.37,57.53 | 31.37,57.53 30.99,57.15 30.99,51.56 | 30.99,51.56 31.24,51.31 32.56,51.31 U5.2 | R63.1 30.61,51.18 30.99,51.56 | R55.1 31.28,57.62 31.37,57.53
N$66
  Top 0.305: R54.2 29.55,60.03 30.35,60.83 32.38,60.83 33.02,60.2 33.02,59.6 R55.2 33.27,59.56 34.42,58.42 34.42,56.77 33.91,56.26 U5.6
N$67
  Top 0.305: R56.2 37.3,51.73 37.21,51.82 37.21,51.94 36.45,52.7 36.45,54.9 R57.1 34.42,55.75 33.66,54.99 U5.5
N$68  (via drill 0.6)
  Top 0.305: U5.3 33.78,52.45 v34.29,51.94 | v38.1,49.02 40.01,47.12 U6.1 40.01,43.01 R60.1
  Bottom 0.305: v34.29,51.94 35.18,51.94 v38.1,49.02
N$69
  Top 0.305: R58.1 32.77,49.84 U5.1
N$70
  Top 0.305: U6.2 41.4,46.02 R61.1 39.7,40.81 R60.2
N$71
  Top 0.305: U6.3 42.55,44.03 C34.1 44.58,41.36 44.58,39.62 43.52,38.57 R62.1
NRST
  Top 0.305: R3.1 C24.1 35.43,10.41 36.31,11.29 IC1.14 36.31,21.34 28.83,28.83 26.67,28.83 25.65,29.72 25.65,31.88 JP7.5
OSC_IN
  Top 0.305: C39.1 23.5,4.32 Q2.2 25.4,5.71 29.34,5.71 34.29,10.67 34.29,11.43 35.31,12.45 IC1.12
OSC_OUT
  Top 0.305: IC1.13 35.81,11.68 34.8,10.67 34.8,10.29 Q2.1 29.84,2.79 C40.1
USART3_RX  (via drill 0.6)
  Top 0.305: IC1.79 29.66,26.34 30.35,25.65 30.35,20.45 v29.97,20.07
  Bottom 0.305: v29.97,20.07 17.4,7.49 13.59,7.49 12.7,6.6 JP8.3
USART3_TX  (via drill 0.6)
  Top 0.305: IC1.78 29.93,26.84 31.11,25.65 v31.11,19.56
  Bottom 0.305: v31.11,19.56 22.35,10.79 22.35,10.67 18.54,6.86 15.62,6.86 15.24,6.48 JP8.2
V+  (via drill 0.6)
  Top 0.305: 34.42,53.72 U5.4 | U6.8 40.04,50.91 C33.1 40.04,55.41 40.39,55.75 | R43.2 49.93,53.24 C27.+ 49.8,55.75 40.39,55.75 | C32.1 34.42,53.72 | 34.42,53.72 v34.42,54.23 | v39.5,55.75 40.39,55.75
  Top 0.61: L3.2 39.19,62.79 43.31,58.67 R30.2 49.95,55.9 C27.+
  Bottom 0.305: v34.42,54.23 37.97,54.23 v39.5,55.75